# EAGLE design DRV10987 (EAGLE 9.6.2)
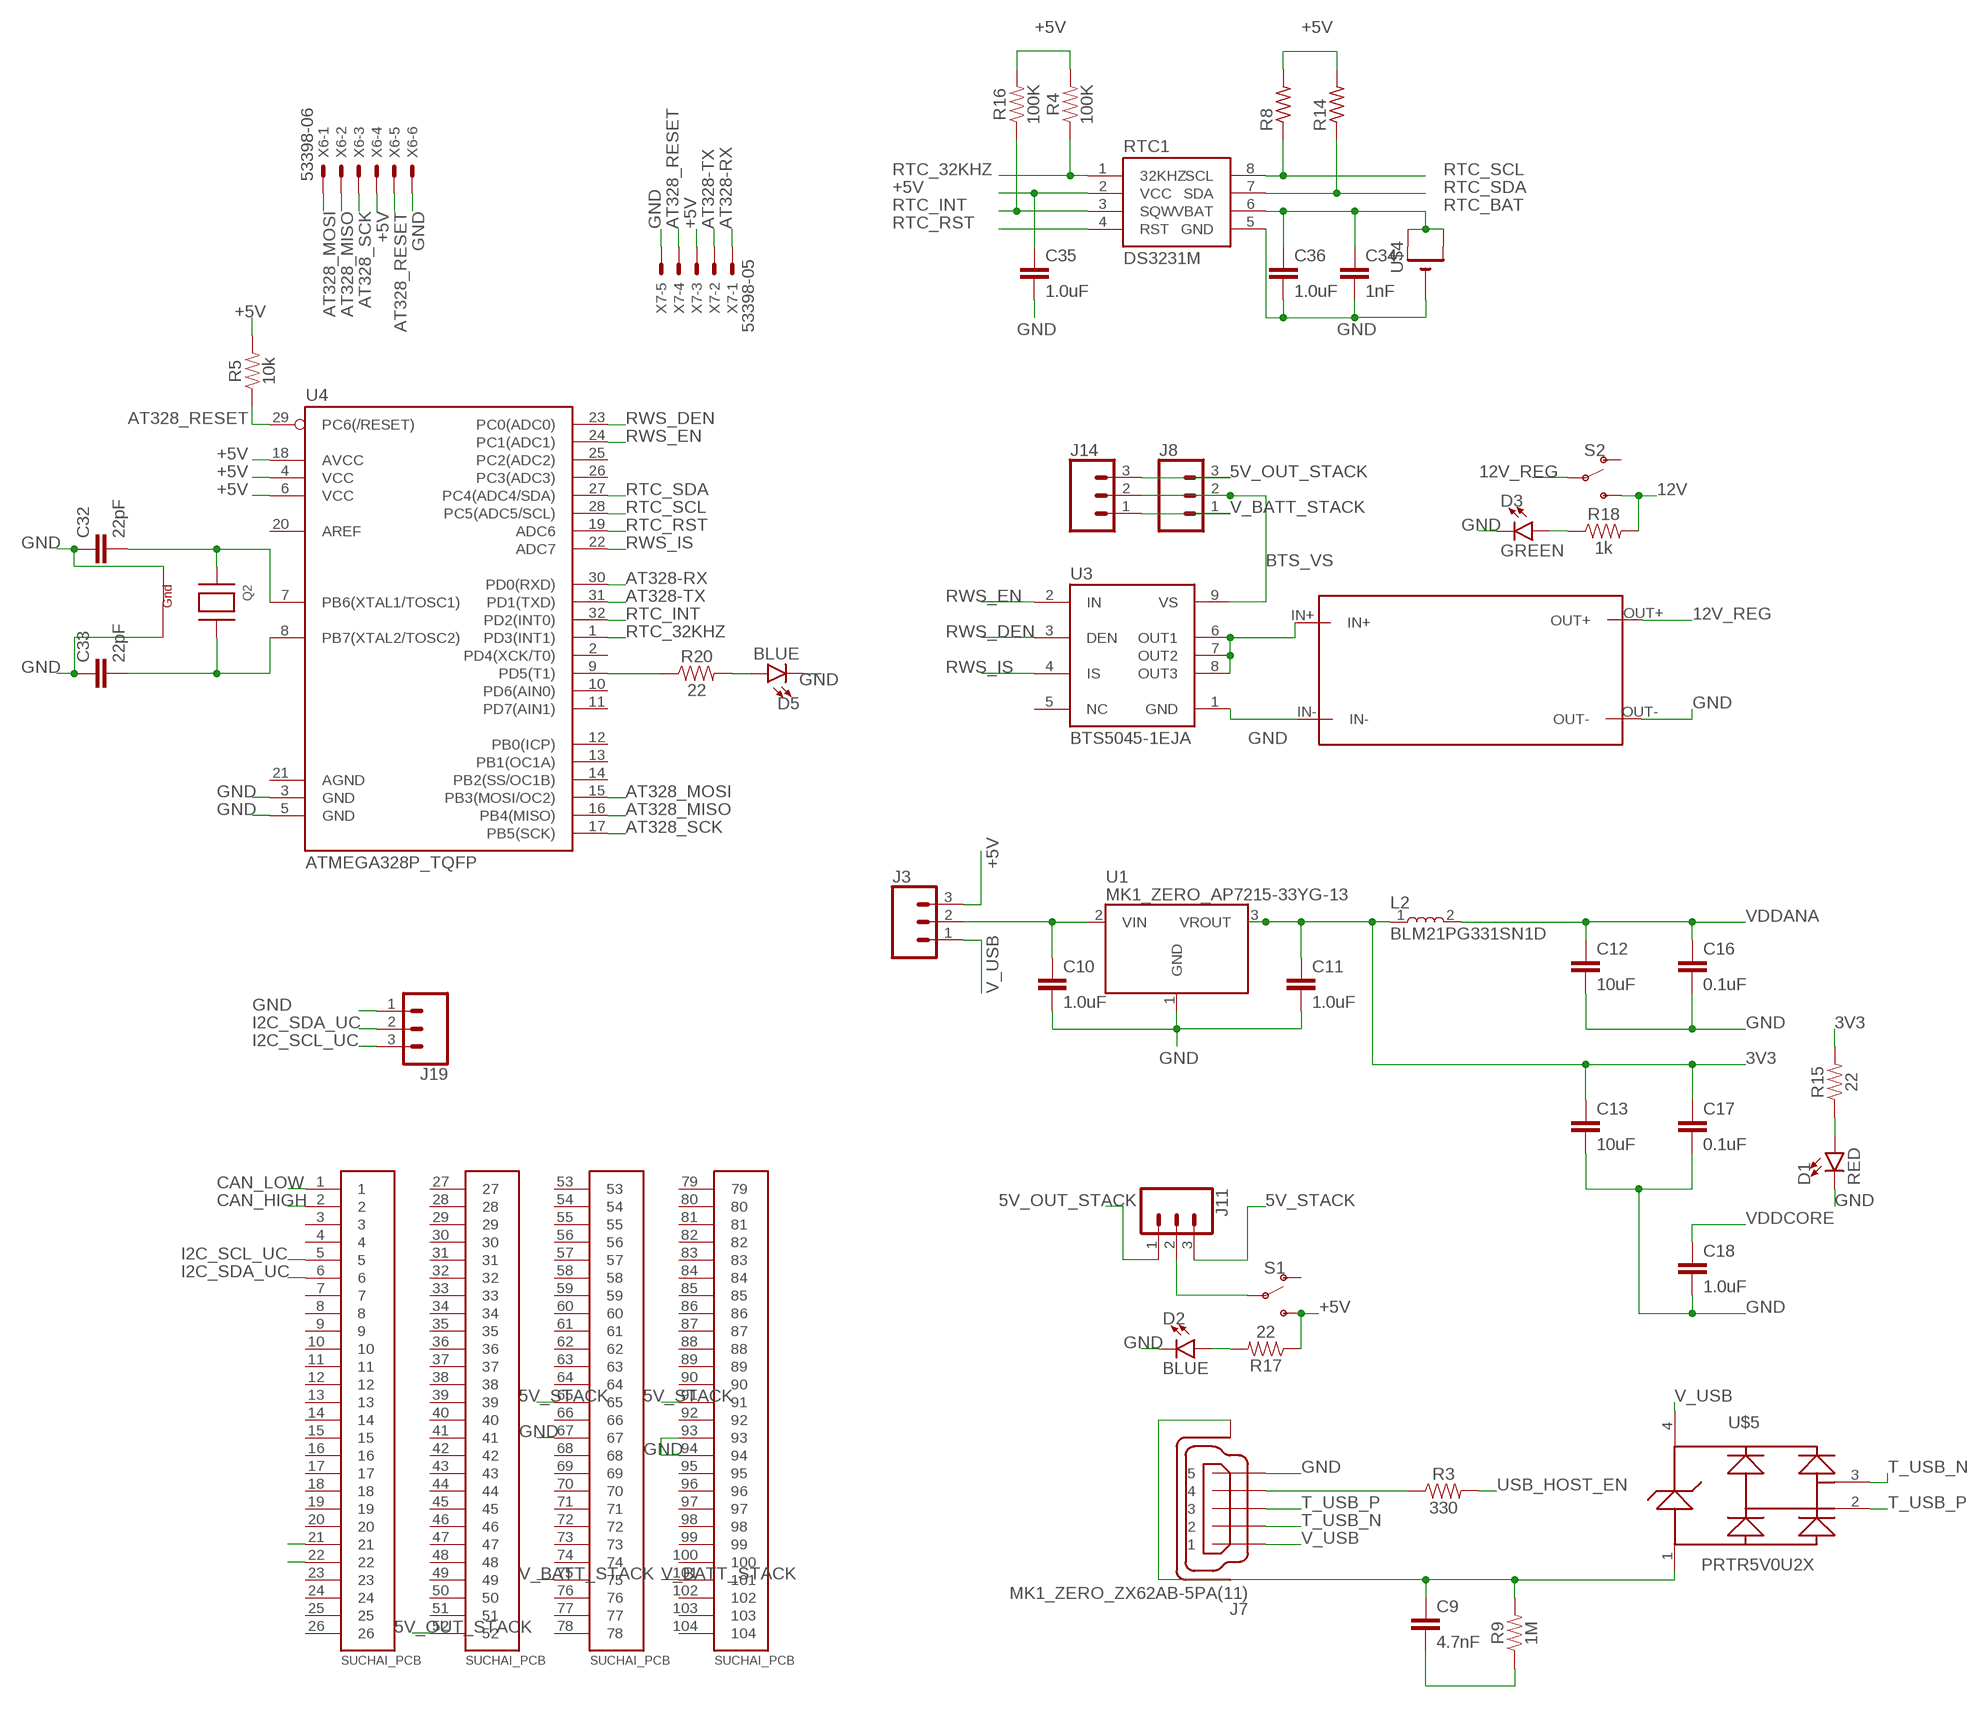
[diagram p0: schematic, sheet 1, part 1 of 2]
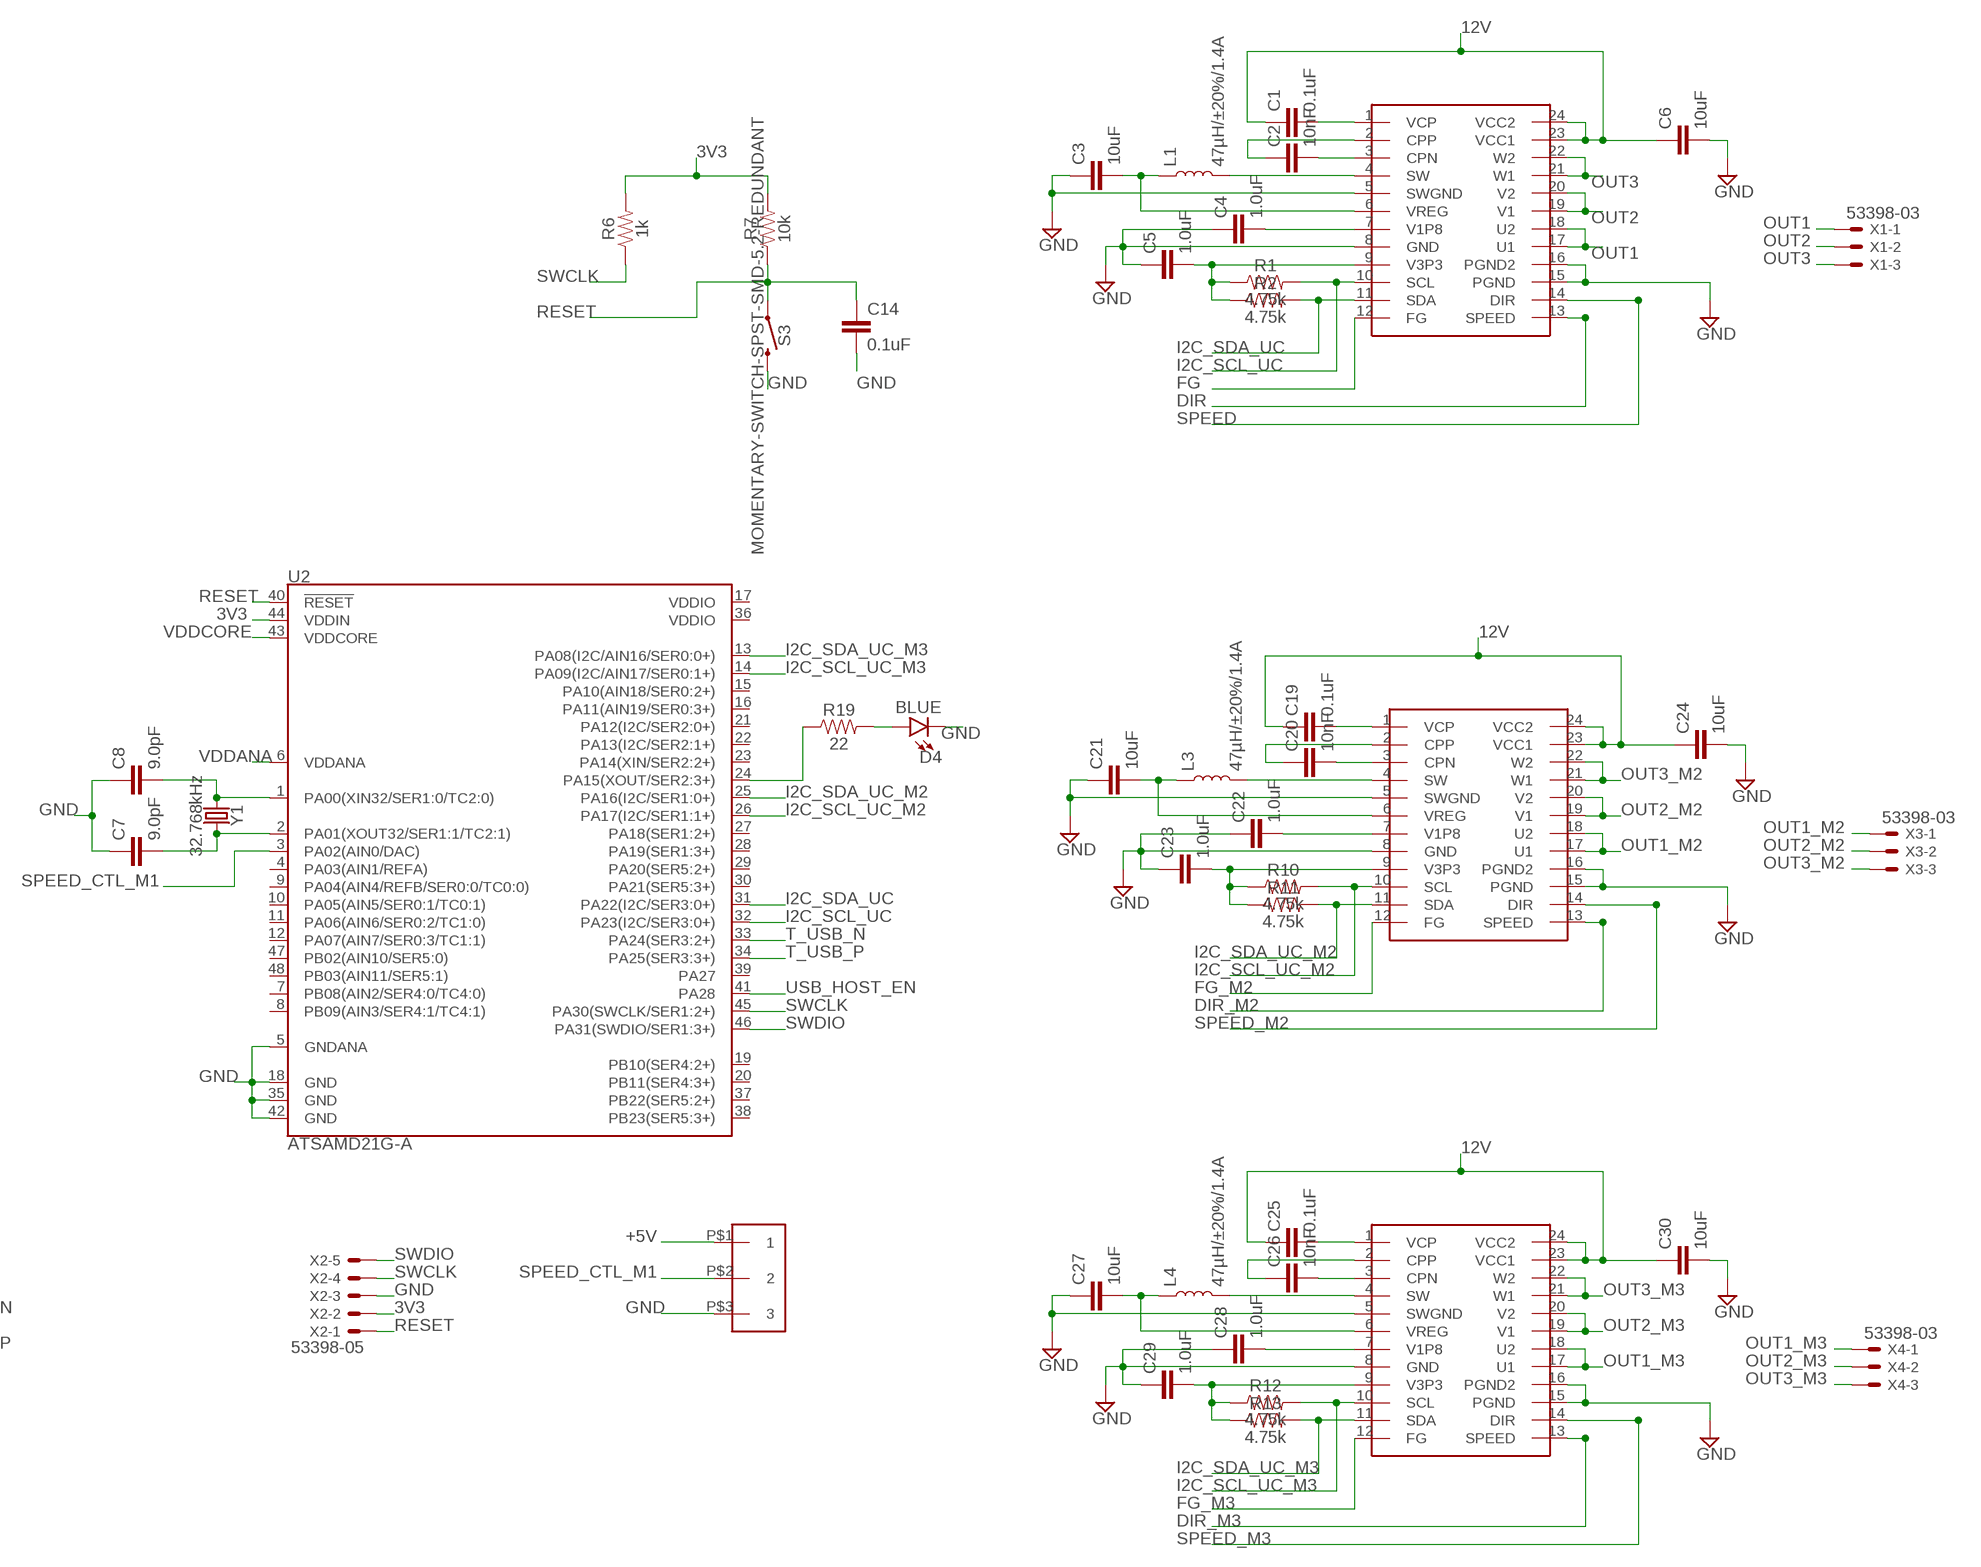
[diagram p1: schematic, sheet 1, part 2 of 2]

## Parts
C1  0.1uF  1.0UF-0805-25V-10%  [0805]
C2  10nF  1.0UF-0805-25V-10%  [0805]
C3  10uF  1.0UF-0805-25V-10%  [0805]
C4  1.0uF  1.0UF-0805-25V-10%  [0805]
C5  1.0uF  1.0UF-0805-25V-10%  [0805]
C6  10uF  1.0UF-0805-25V-10%  [0805]
C7  9.0pF  9.0PF-0603-50V-10%  [0603]
C8  9.0pF  9.0PF-0603-50V-10%  [0603]
C9  4.7nF  4.7PF-0603-50V-5%  [0603]
C10  1.0uF  1.0UF-0805-25V-(+80/-20%)  [0805]
C11  1.0uF  1.0UF-0805-25V-(+80/-20%)  [0805]
C12  10uF  10UF-0805-10V-10%  [0805]
C13  10uF  10UF-0805-10V-10%  [0805]
C14  0.1uF  1.0UF-0805-25V-(+80/-20%)  [0805]
C16  0.1uF  1.0UF-0805-25V-(+80/-20%)  [0805]
C17  0.1uF  1.0UF-0805-25V-(+80/-20%)  [0805]
C18  1.0uF  1.0UF-0805-25V-(+80/-20%)  [0805]
C19  0.1uF  1.0UF-0805-25V-10%  [0805]
C20  10nF  1.0UF-0805-25V-10%  [0805]
C21  10uF  1.0UF-0805-25V-10%  [0805]
C22  1.0uF  1.0UF-0805-25V-10%  [0805]
C23  1.0uF  1.0UF-0805-25V-10%  [0805]
C24  10uF  1.0UF-0805-25V-10%  [0805]
C25  0.1uF  1.0UF-0805-25V-10%  [0805]
C26  10nF  1.0UF-0805-25V-10%  [0805]
C27  10uF  1.0UF-0805-25V-10%  [0805]
C28  1.0uF  1.0UF-0805-25V-10%  [0805]
C29  1.0uF  1.0UF-0805-25V-10%  [0805]
C30  10uF  1.0UF-0805-25V-10%  [0805]
C32  22pF  22PF-0603-50V-5%  [0603]
C33  22pF  22PF-0603-50V-5%  [0603]
C34  1nF  1.0NF/1000PF-0603-50V-10%  [0603]
C35  1.0uF  1.0UF-0402-16V-10%  [0402]
C36  1.0uF  1.0UF-0402-16V-10%  [0402]
D1  RED  LED-RED0603  [LED-0603]
D2  BLUE  LED-BLUE0603  [LED-0603]
D3  GREEN  LED-GREEN0603  [LED-0603]
D4  BLUE  LED-BLUE0603  [LED-0603]
D5  BLUE  LED-BLUE0603  [LED-0603]
J1  SUCHAI_PCB  [SUCHAI_PCB]
J3  CONN_03LOCK_LONGPADS  [1X03_LOCK_LONGPADS]
J7  MK1_ZERO_ZX62AB-5PA(11)  [MK1_ZERO_USBMICRO-ZX62-AB-5PA]
J8  CONN_03LOCK  [1X03_LOCK]
J11  CONN_03LOCK  [1X03_LOCK]
J14  CONN_03LOCK  [1X03_LOCK]
J19  CONN_03LOCK  [1X03_LOCK]
L1  47µH/±20%/1.4A  INDUCTOR-SRN6045-33UH  [SRN6045]
L2  BLM21PG331SN1D  [INDC2012X87]
L3  47µH/±20%/1.4A  INDUCTOR-SRN6045-33UH  [SRN6045]
L4  47µH/±20%/1.4A  INDUCTOR-SRN6045-33UH  [SRN6045]
Q2  XTAL-4-3225  [NX3225]
R1  4.75k  RESISTOR0805  [0805]
R2  4.75k  RESISTOR0805  [0805]
R3  330  330OHM-0603-1/10W-1%  [0603]
R4  100K  100KOHM-0402-1/16W-1%  [0402]
R5  10k  10KOHM-0603-1/10W-1%  [0603]
R6  1k  1KOHM-0603-1/10W-1%  [0603]
R7  10k  10KOHM-0603-1/10W-1%  [0603]
R8  R-US_R0402  [R0402]
R9  1M  1MOHM-0603-1/4W-5%  [0603]
R10  4.75k  RESISTOR0805  [0805]
R11  4.75k  RESISTOR0805  [0805]
R12  4.75k  RESISTOR0805  [0805]
R13  4.75k  RESISTOR0805  [0805]
R14  R-US_R0402  [R0402]
R15  22  22OHM-0603-1/10W-1%  [0603]
R16  100K  100KOHM-0402-1/16W-1%  [0402]
R17  22  22OHM-0603-1/10W-1%  [0603]
R18  1k  1KOHM-0603-1/10W-1%  [0603]
R19  22  22OHM-0603-1/10W-1%  [0603]
R20  22  22OHM-0603-1/10W-1%  [0603]
RTC1  DS3231M  [SO08]
S1  SWITCH-SPDT-PTH-11.6X4.0MM  [SWITCH_SPDT_PTH_11.6X4.0MM]
S2  SWITCH-SPDT-PTH-11.6X4.0MM  [SWITCH_SPDT_PTH_11.6X4.0MM]
S3  MOMENTARY-SWITCH-SPST-SMD-5.2-REDUNDANT  [TACTILE_SWITCH_SMD_5.2MM]
U1  MK1_ZERO_AP7215-33YG-13  [MK1_ZERO_SOT150P400X160-3N]
U2  ATSAMD21G-A  [TQFP-48]
U3  BTS5045-1EJA  [SOIC127P600X170-9N]
U4  ATMEGA328P_TQFP  [TQFP32-08]
U$1  DRV10987  [DRV10987]
U$2  XL6009E1_MODULE  [XL6009E1_MODULE]
U$3  CONN_03_SMD_SMALL  [CONN_03_SMD_SMALL]
U$4  CR1220SMT  [CR1220-SMD]
U$5  ARDUINO_PRTR5V0U2XB  [ARDUINO_SOT143B]
U$6  DRV10987  [DRV10987]
U$7  DRV10987  [DRV10987]
X1  53398-03  [53398-03]
X2  53398-05  [53398-05]
X3  53398-03  [53398-03]
X4  53398-03  [53398-03]
X6  53398-06  [53398-06]
X7  53398-05  [53398-05]
Y1  32.768kHz  CRYSTAL-32.768KHZSMD-3.2X1.5  [CRYSTAL-SMD-3.2X1.5MM]

## Nets
3V3: C11.1 C13.1 C17.1 L2.1 R6.2 R7.2 R15.2 U1.3(VROUT) U2.44(VDDIN) X2.2
5V_OUT_STACK: J1.52 J8.3 J11.1 J14.3
5V_STACK: J1.65 J1.91 J11.3
12V: C1.1 C6.1 C19.1 C24.1 C25.1 C30.1 R18.2 S2.3(S) U$1.23(VCC1) U$1.24(VCC2) U$6.23(VCC1) U$6.24(VCC2) U$7.23(VCC1) U$7.24(VCC2)
12V_REG: S2.2(P) U$2.OUT+
+5V: C35.1 J3.3 R4.2 R5.2 R8.2 R14.2 R16.2 R17.1 RTC1.2(VCC) S1.3(S) U4.4(VCC) U4.6(VCC) U4.18(AVCC) U$3.P$1 X6.4 X7.3
AT328-RX: U4.30(PD0(RXD)) X7.1
AT328-TX: U4.31(PD1(TXD)) X7.2
AT328_MISO: U4.16(PB4(MISO)) X6.2
AT328_MOSI: U4.15(PB3(MOSI/OC2)) X6.1
AT328_RESET: R5.1 U4.29(PC6(/RESET)) X6.5 X7.4
AT328_SCK: U4.17(PB5(SCK)) X6.3
BTS_VS: J8.2 J14.2 U3.9(VS)
CAN_HIGH: J1.2
CAN_LOW: J1.1
DIR: U$1.13(SPEED)
DIR_M2: U$6.13(SPEED)
DIR_M3: U$7.13(SPEED)
FG: U$1.12(FG)
FG_M2: U$6.12(FG)
FG_M3: U$7.12(FG)
GND: C3.1 C4.1 C5.1 C6.2 C7.1 C8.1 C10.2 C11.2 C12.2 C13.2 C14.2 C16.2 C17.2 C18.2 C21.1 C22.1 C23.1 C24.2 C27.1 C28.1 C29.1 C30.2 C32.1 C33.1 C34.2 C35.2 C36.2 D1.C D2.C D3.C D4.C D5.C J1.67 J1.93 J1.94 J7.5 J19.1 Q2.2(G2) Q2.4(G1) RTC1.5(GND) S3.3 S3.4 U1.1(GND) U2.5(GNDANA) U2.18(GND) U2.35(GND) U2.42(GND) U3.1(GND) U4.3(GND) U4.5(GND) U$1.5(SWGND) U$1.8(GND) U$1.15(PGND) U$1.16(PGND2) U$2.IN- U$2.OUT- U$3.P$3 U$4.- U$6.5(SWGND) U$6.8(GND) U$6.15(PGND) U$6.16(PGND2) U$7.5(SWGND) U$7.8(GND) U$7.15(PGND) U$7.16(PGND2) X2.3 X6.6 X7.5
I2C_SCL_UC: J1.5 J19.3 R1.2 U2.32(PA23(I2C/SER3:0+)) U$1.10(SCL)
I2C_SCL_UC_M2: R10.2 U2.26(PA17(I2C/SER1:1+)) U$6.10(SCL)
I2C_SCL_UC_M3: R12.2 U2.14(PA09(I2C/AIN17/SER0:1+)) U$7.10(SCL)
I2C_SDA_UC: J1.6 J19.2 R2.2 U2.31(PA22(I2C/SER3:0+)) U$1.11(SDA)
I2C_SDA_UC_M2: R11.2 U2.25(PA16(I2C/SER1:0+)) U$6.11(SDA)
I2C_SDA_UC_M3: R13.2 U2.13(PA08(I2C/AIN16/SER0:0+)) U$7.11(SDA)
N$1: C1.2 U$1.1(VCP)
N$2: C2.1 U$1.2(CPP)
N$3: C2.2 U$1.3(CPN)
N$4: L1.2 U$1.4(SW)
N$5: J11.2 S1.2(P)
N$6: C3.2 L1.1 U$1.6(VREG)
N$7: C4.2 U$1.7(V1P8)
N$8: C7.2 U2.2(PA01(XOUT32/SER1:1/TC2:1)) Y1.P$2
N$9: C5.2 R1.1 R2.1 U$1.9(V3P3)
N$10: C8.2 U2.1(PA00(XIN32/SER1:0/TC2:0)) Y1.P$1
N$11: J7.4 R3.1
N$12: U3.6(OUT1) U3.7(OUT2) U3.8(OUT3) U$2.IN+
N$13: C32.2 Q2.1(X1) U4.7(PB6(XTAL1/TOSC1))
N$14: C33.2 Q2.3(X2) U4.8(PB7(XTAL2/TOSC2))
N$15: D1.A R15.1
N$16: J1.21
N$17: C9.1 J7.6(SH) J7.7(SH) J7.8(SH) J7.9(SH) J7.10(SH) J7.11(SH) R9.2 U$5.1
N$18: J1.22
N$19: C9.2 R9.1
N$20: C10.1 J3.2 U1.2(VIN)
N$21: D2.A R17.2
N$22: C19.2 U$6.1(VCP)
N$23: C20.1 U$6.2(CPP)
N$24: C20.2 U$6.3(CPN)
N$25: L3.2 U$6.4(SW)
N$26: C21.2 L3.1 U$6.6(VREG)
N$27: C22.2 U$6.7(V1P8)
N$28: C23.2 R10.1 R11.1 U$6.9(V3P3)
N$29: C25.2 U$7.1(VCP)
N$30: C26.1 U$7.2(CPP)
N$31: C26.2 U$7.3(CPN)
N$32: L4.2 U$7.4(SW)
N$33: C27.2 L4.1 U$7.6(VREG)
N$34: C28.2 U$7.7(V1P8)
N$35: C29.2 R12.1 R13.1 U$7.9(V3P3)
N$36: D3.A R18.1
N$37: D4.A R19.2
N$38: R19.1 U2.24(PA15(XOUT/SER2:3+))
N$39: D5.A R20.2
N$40: R20.1 U4.9(PD5(T1))
OUT1: U$1.17(U1) U$1.18(U2) X1.1
OUT1_M2: U$6.17(U1) U$6.18(U2) X3.1
OUT1_M3: U$7.17(U1) U$7.18(U2) X4.1
OUT2: U$1.19(V1) U$1.20(V2) X1.2
OUT2_M2: U$6.19(V1) U$6.20(V2) X3.2
OUT2_M3: U$7.19(V1) U$7.20(V2) X4.2
OUT3: U$1.21(W1) U$1.22(W2) X1.3
OUT3_M2: U$6.21(W1) U$6.22(W2) X3.3
OUT3_M3: U$7.21(W1) U$7.22(W2) X4.3
RESET: C14.1 R7.1 S3.1 S3.2 U2.40(!RESET!) X2.1
RTC_32KHZ: R4.1 RTC1.1(32KHZ) U4.1(PD3(INT1))
RTC_BAT: C34.1 C36.1 RTC1.6(VBAT) U$4.+$1(+) U$4.+$2(+1)
RTC_INT: R16.1 RTC1.3(SQW) U4.32(PD2(INT0))
RTC_RST: RTC1.4(RST) U4.19(ADC6)
RTC_SCL: R8.1 RTC1.8(SCL) U4.28(PC5(ADC5/SCL))
RTC_SDA: R14.1 RTC1.7(SDA) U4.27(PC4(ADC4/SDA))
RWS_DEN: U3.3(DEN) U4.23(PC0(ADC0))
RWS_EN: U3.2(IN) U4.24(PC1(ADC1))
RWS_IS: U3.4(IS) U4.22(ADC7)
SPEED: U$1.14(DIR)
SPEED_CTL_M1: U2.3(PA02(AIN0/DAC)) U$3.P$2
SPEED_M2: U$6.14(DIR)
SPEED_M3: U$7.14(DIR)
SWCLK: R6.1 U2.45(PA30(SWCLK/SER1:2+)) X2.4
SWDIO: U2.46(PA31(SWDIO/SER1:3+)) X2.5
T_USB_N: J7.2 U2.33(PA24(SER3:2+)) U$5.3
T_USB_P: J7.3 U2.34(PA25(SER3:3+)) U$5.2
USB_HOST_EN: R3.2 U2.41(PA28)
V_BATT_STACK: J1.75 J1.101 J8.1 J14.1
V_USB: J3.1 J7.1 U$5.4
VDDANA: C12.1 C16.1 L2.2 U2.6(VDDANA)
VDDCORE: C18.1 U2.43(VDDCORE)
Unconnected: J1.3 J1.4 J1.7 J1.8 J1.9 J1.10 J1.11 J1.12 J1.13 J1.14 J1.15 J1.16 J1.17 J1.18 J1.19 J1.20 J1.23 J1.24 J1.25 J1.26 J1.27 J1.28 J1.29 J1.30 J1.31 J1.32 J1.33 J1.34 J1.35 J1.36 J1.37 J1.38 J1.39 J1.40 J1.41 J1.42 J1.43 J1.44 J1.45 J1.46 J1.47 J1.48 J1.49 J1.50 J1.51 J1.53 J1.54 J1.55 J1.56 J1.57 J1.58 J1.59 J1.60 J1.61 J1.62 J1.63 J1.64 J1.66 J1.68 J1.69 J1.70 J1.71 J1.72 J1.73 J1.74 J1.76 J1.77 J1.78 J1.79 J1.80 J1.81 J1.82 J1.83 J1.84 J1.85 J1.86 J1.87 J1.88 J1.89 J1.90 J1.92 J1.95 J1.96 J1.97 J1.98 J1.99 J1.100 J1.102 J1.103 J1.104 S1.1(O) S2.1(O) U2.4(PA03(AIN1/REFA)) U2.7(PB08(AIN2/SER4:0/TC4:0)) U2.8(PB09(AIN3/SER4:1/TC4:1)) U2.9(PA04(AIN4/REFB/SER0:0/TC0:0)) U2.10(PA05(AIN5/SER0:1/TC0:1)) U2.11(PA06(AIN6/SER0:2/TC1:0)) U2.12(PA07(AIN7/SER0:3/TC1:1)) U2.15(PA10(AIN18/SER0:2+)) U2.16(PA11(AIN19/SER0:3+)) U2.17(VDDIO) U2.19(PB10(SER4:2+)) U2.20(PB11(SER4:3+)) U2.21(PA12(I2C/SER2:0+)) U2.22(PA13(I2C/SER2:1+)) U2.23(PA14(XIN/SER2:2+)) U2.27(PA18(SER1:2+)) U2.28(PA19(SER1:3+)) U2.29(PA20(SER5:2+)) U2.30(PA21(SER5:3+)) U2.36(VDDIO) U2.37(PB22(SER5:2+)) U2.38(PB23(SER5:3+)) U2.39(PA27) U2.47(PB02(AIN10/SER5:0)) U2.48(PB03(AIN11/SER5:1)) U3.5(NC) U4.2(PD4(XCK/T0)) U4.10(PD6(AIN0)) U4.11(PD7(AIN1)) U4.12(PB0(ICP)) U4.13(PB1(OC1A)) U4.14(PB2(SS/OC1B)) U4.20(AREF) U4.21(AGND) U4.25(PC2(ADC2)) U4.26(PC3(ADC3))

## Library data of the parts
C1-C3 C6 C19-C21 C24-C27 C30 = SparkFun-Capacitors:1.0UF: 1µF ceramic capacitors A capacitor is a passive two-terminal electrical component used to store electrical energy temporarily in an electric field.; PROD_ID: CAP-08064; VALUE: 1.0uF
C4 C5 C22 C23 C28 C29 = SparkFun-Capacitors:1.0UF: 1µF ceramic capacitors A capacitor is a passive two-terminal electrical component used to store electrical energy temporarily in an electric field.; PROD_ID: CAP-08064
C7 C8 = SparkFun-Capacitors:9.0PF: 9.0pF ceramic capacitors A capacitor is a passive two-terminal electrical component used to store electrical energy temporarily in an electric field.; PROD_ID: CAP-09341
C9 = SparkFun-Capacitors:4.7PF: 4.7pF ceramic capacitors A capacitor is a passive two-terminal electrical component used to store electrical energy temporarily in an electric field.; PROD_ID: CAP-07880; VALUE: 4.7pF
C10 C11 C18 = SparkFun-Capacitors:1.0UF: 1µF ceramic capacitors A capacitor is a passive two-terminal electrical component used to store electrical energy temporarily in an electric field.; PROD_ID: CAP-11625
C12 C13 = SparkFun-Capacitors:10UF: 10.0µF ceramic capacitors A capacitor is a passive two-terminal electrical component used to store electrical energy temporarily in an electric field.; PROD_ID: CAP-11330
C14 C16 C17 = SparkFun-Capacitors:1.0UF: 1µF ceramic capacitors A capacitor is a passive two-terminal electrical component used to store electrical energy temporarily in an electric field.; PROD_ID: CAP-11625; VALUE: 1.0uF
C32 C33 = SparkFun-Capacitors:22PF: 22pF ceramic capacitors A capacitor is a passive two-terminal electrical component used to store electrical energy temporarily in an electric field.; PROD_ID: CAP-07876
C34 = SparkFun-Capacitors:1.0NF/1000PF: 1nF/1,000pF ceramic capacitors A capacitor is a passive two-terminal electrical component used to store electrical energy temporarily in an electric field.; PROD_ID: CAP-07886
C35 C36 = SparkFun-Capacitors:1.0UF: 1µF ceramic capacitors A capacitor is a passive two-terminal electrical component used to store electrical energy temporarily in an electric field.; PROD_ID: CAP-12417
D1 = SparkFun-LED:LED-RED: Red SMD LED Used in manufacturing of most products at SparkFun Packages: 0603 - SMD 0603 package [Product Link] <http://docs.avagotech.com/docs/AV02-0551EN> 0603 SMART - SMD 0603 SMART package ( more efficient and expensive)[Product Link] <http://www.osram-os.com/Graphics/XPic2/00077099_0.pdf> 1206 - SMD1206 package [Product Link] <https://www.sparkfun.com/datasheets/DevTools/LilyPad/Q150OVS4.pdff> SparkFun Products: Pro Mini 328 -5V <https://www.sparkfun.com/products/821> RedBoard <https://www.sparkfun.com/products/12757> IOIO-OTG <https://www.sparkfun.com/products/13613>; PROD_ID: DIO-00819
D2 D4 D5 = SparkFun-LED:LED-BLUE: Blue SMD LED Used in manufacturing of various products at SparkFun Packages: 0603 - SMD 0603 package [Product Link] <http://www.digikey.com/product-detail/en/SMLE12BC7TT86/511-1589-2-ND/1641808> 1206 - SMD1206 package [Product Link] <http://www.digikey.com/product-detail/en/lite-on-inc/LTST-C150TBKT/160-1643-1-ND/573584> SparkFun Products: ESP8266 Thing-Dev Board <https://www.sparkfun.com/products/13711> RedBoard <https://www.sparkfun.com/products/12757>; PROD_ID: DIO-08575
D3 = SparkFun-LED:LED-GREEN: Green SMD LED Used in manufacturing of various products at SparkFun Packages: 0603 - SMD 0603 package [Product Link] <http://www.futureelectronics.com/en/technologies/semiconductors/optoelectronics/leds/Pages/9894312-LTST-C190GKT.aspx?CrossPart=HSMG-C190&IM=0> LilyPad 1206 - SMD1206 LilyPad package [Product Link] <http://www.futureelectronics.com/en/Technologies/Product.aspx?ProductID=IN150NGHARVATEKCORPORATION2049943&IM=0> 1206 - SMD1206 package [Product Link] <http://www.futureelectronics.com/en/technologies/semiconductors/optoelectronics/leds/Pages/8315665-LTST-C150KGKT.aspx?IM=0> 1206 Bottom Mount -SMD 1206 Bottom Mount [Product Link] <http://www.digikey.com/product-detail/en/lite-on-inc/LTST-C230KGKT/160-1456-1-ND/386854> SparkFun Products: Pro Mini 328 -5V <https://www.sparkfun.com/products/821> RedBoard <https://www.sparkfun.com/products/12757> MP3 Trigger <https://www.sparkfun.com/products/13720> Makey Makey <https://www.sparkfun.com/products/11076>; PROD_ID: DIO-00821
J1 = SUCHAI_PCB:SUCHAI_PCB: ASSEMBLY, SOCKET STRIP .016 X .031 TAIL.
J3 J8 J11 J14 J19 = SparkFun-Connectors:CONN_03: Multi connection point. Often used as Generic Header-pin footprint for 0.1 inch spaced/style header connections On any of the 0.1 inch spaced packages, you can populate with these: Break Away Headers - Straight <https://www.sparkfun.com/products/116> (PRT-00116) Break Away Male Headers - Right Angle <https://www.sparkfun.com/products/553> (PRT-00553) Female Headers <https://www.sparkfun.com/products/115> (PRT-00115) Break Away Headers - Machine Pin <https://www.sparkfun.com/products/117> (PRT-00117) Break Away Female Headers - Swiss Machine Pin <https://www.sparkfun.com/products/743> (PRT-00743) Stackable Header - 3 Pin (Female, 0.1") <https://www.sparkfun.com/products/13875> (PRT-13875) For SCREWTERMINALS and SPRING TERMINALS visit here: Screw Terimnals on SparkFun.com <https://www.sparkfun.com/search/results?term=Screw+Terminals> (5mm/3.5mm/2.54mm spacing) This device is also useful as a general connection point to wire up your design to another part of your project. Our various solder wires solder well into these plated through hole pads. Hook-Up Wire - Assortment (Stranded, 22 AWG) <https://www.sparkfun.com/products/11375> (PRT-11375) Hook-Up Wire - Assortment (Solid Core, 22 AWG) <https://www.sparkfun.com/products/11367> (PRT-11367) View the entire wire category on our website here <https://www.sparkfun.com/categories/141> Special notes: Molex polarized connector foot print use with SKU : PRT-08232 with associated crimp pins and housings.
J7 = MKRZero_V5.0:MK1_ZERO_ZX62AB-5PA(11)
L1 L3 L4 = SparkFun-Coils:INDUCTOR: Inductors Resist changes in electrical current. Basically a coil of wire. SparkFun Products: SparkFun Load Cell Amplifier - HX711 <https://www.sparkfun.com/products/13879> IOIO-OTG - V2.2 <https://www.sparkfun.com/products/13613>; PROD_ID: NDUC-11627; VALUE: 33µH/±20%/1.4A
L2 = Common-Parts-Library-Eagle:BLM21PG331SN1D: Ferrite Beads Multi-Layer 330Ohm 25% 100MHz 1.5A 70mOhm DCR 0805 Paper T/R; MANUFACTURER: MURATA
Q2 = adafruit:XTAL-4: Classic 4-pin 3.2 x 2.5mm crystal
R1 R2 R10-R13 = SparkFun-Resistors:RESISTOR: Generic Resistor Package
R3 = SparkFun-Resistors:330OHM: 330Ω resistor A resistor is a passive two-terminal electrical component that implements electrical resistance as a circuit element. Resistors act to reduce current flow, and, at the same time, act to lower voltage levels within circuits. - Wikipedia; PROD_ID: RES-00818
R4 R16 = SparkFun-Resistors:100KOHM: 100kΩ resistor A resistor is a passive two-terminal electrical component that implements electrical resistance as a circuit element. Resistors act to reduce current flow, and, at the same time, act to lower voltage levels within circuits. - Wikipedia; PROD_ID: RES-13495
R5 R7 = SparkFun-Resistors:10KOHM: 10kΩ resistor A resistor is a passive two-terminal electrical component that implements electrical resistance as a circuit element. Resistors act to reduce current flow, and, at the same time, act to lower voltage levels within circuits. - Wikipedia; PROD_ID: RES-00824
R6 R18 = SparkFun-Resistors:1KOHM: 1kΩ resistor A resistor is a passive two-terminal electrical component that implements electrical resistance as a circuit element. Resistors act to reduce current flow, and, at the same time, act to lower voltage levels within circuits. - Wikipedia; PROD_ID: RES-07856
R8 R14 = adafruit:R-US_: RESISTOR, American symbol
R9 = SparkFun-Resistors:1MOHM: 1MΩ resistor A resistor is a passive two-terminal electrical component that implements electrical resistance as a circuit element. Resistors act to reduce current flow, and, at the same time, act to lower voltage levels within circuits. - Wikipedia; PROD_ID: RES-07868
R15 R17 R19 R20 = SparkFun-Resistors:22OHM: 22Ω resistor A resistor is a passive two-terminal electrical component that implements electrical resistance as a circuit element. Resistors act to reduce current flow, and, at the same time, act to lower voltage levels within circuits. - Wikipedia; PROD_ID: RES-08698
RTC1 = SparkFun-Clocks:DS3231M: DS3231M Real Time Clock Accuracy +/-5ppm. Battery Backup. 2.3V to 5.5V. Datasheet <https://cdn.sparkfun.com/datasheets/Dev/Beagle/DS3231M.pdf> SparkFun Products CryptoCape <https://www.sparkfun.com/products/12773> (DEV-12773) SparkFun CryptoShield <https://www.sparkfun.com/products/13183> (DEV-13183); PROD_ID: IC-11985
S1 S2 = SparkFun-Switches:SWITCH-SPDT: Single Pole, Double Throw (SPDT) Switch Single-pole, double-throw (SPDT) switch. Variant Overview SMD-AYZ0202 Surface Mount DPDT Switch <https://www.sparkfun.com/products/597> (COM-00597) Used on e.g. LilyPad Arduino USB - ATmega32U4 Board <https://www.sparkfun.com/products/12049> PTH-11.6X4.0MM SPDT Mini Power Switch <https://www.sparkfun.com/products/102> (COM-00102) Used on e.g. SparkFun Simon Says - Through-Hole Soldering Kit <https://www.sparkfun.com/products/10547> (KIT-10547) PTH-11.6X4.0MM-KIT KIT version of SPDT Mini Power Switch - Simplifies soldering by removing tStop of switch pins - only one side can be soldered. PTH-11.6X4.0MM-LOCK LOCK version of SPDT Mini Power Switch - Offset pins hold switch in place for easier soldering. SMD-RIGHT-ANGLE Surface Mount Right Angle Switch <https://www.sparkfun.com/products/10860> (COM-10860) Used on e.g. SparkFun ESP8266 Thing <https://www.sparkfun.com/products/13231>; PROD_ID: SWCH-08261; SF_SKU: COM-00102
S3 = SparkFun-Switches:MOMENTARY-SWITCH-SPST: Momentary Switch (Pushbutton) - SPST Normally-open (NO) SPST momentary switches (buttons, pushbuttons). Variants PTH-12MM - 12mm square, through-hole Momentary Pushbutton Switch - 12mm Square <https://www.sparkfun.com/products/9190> (COM-09190) PTH-6.0MM, PTH-6.0MM-KIT - 6.0mm square, through-hole Mini Pushbutton Switch <https://www.sparkfun.com/products/97> (COM-00097) KIT package intended for soldering kit's - only one side of pads' copper is exposed. PTH-RIGHT-ANGLE-KIT - Right-angle, through-hole Right Angle Tactile Button <https://www.sparkfun.com/products/10791> - Used on SparkFun BigTime Watch Kit <https://www.sparkfun.com/products/11734> SMD-12MM - 12mm square, surface-mount Tactile Button - SMD (12mm) <https://www.sparkfun.com/products/12993> (COM-12993) Used on SparkFun PicoBoard <https://www.sparkfun.com/products/11888> SMD-4.5MM - 4.5mm Square Trackball Switch Used on SparkFun Blackberry Trackballer Breakout <https://www.sparkfun.com/products/13169> SMD-4.6MMX2.8MM - 4.60mm x 2.80mm, surface mount Used on SparkFun SAMD21 Mini Breakout <https://www.sparkfun.com/products/13664> SMD-5.2MM, SMD-5.2-REDUNDANT - 5.2mm square, surface-mount Mini Pushbutton Switch - SMD <https://www.sparkfun.com/products/8720> (COM-08720) Used on Arduino Pro Mini <https://www.sparkfun.com/products/11114> REDUNDANT package connects both switch circuits together SMD-6.0X3.5MM - 6.0 x 3.5mm, surface mount Momentary Reset Switch SMD <https://www.sparkfun.com/products/8229> (COM-08229) SMD-6.2MM-TALL - 6.2mm square, surface mount Tactile Button - SMD (6mm) <https://www.sparkfun.com/products/12992> Used on SparkFun Digital Sandbox <https://www.sparkfun.com/products/12651> SMD-RIGHT-ANGLE - Right-angle, surface mount Used on SparkFun Block for Intel® Edison - Arduino <https://www.sparkfun.com/products/13036>; PROD_ID: SWCH-08247; SF_SKU: COM-08720
U1 = MKRZero_V5.0:MK1_ZERO_AP7215-33YG-13: IC REG LDO 3.3V 0.6A SOT89-3 Datasheet <http://www.diodes.com/_files/datasheets/AP7215.pdf>; DESCR: IC REG LDO 3.3V 0.6A SOT89-3; MF: Diodes Inc; MPN: AP7215-33YG-13
U2 = SparkFun-IC-Microcontroller:ATSAMD21G: Atmel SAMD21G SMART ARM-Based Microcontroller The Atmel ® | SMART ™ SAM D21 is a series of low-power microcontrollers using the 32-bit ARM ® Cortex ® -M0+ processor, and ranging from 32- to 64-pins with up to 256KB Flash and 32KB of SRAM. The SAM D21 devices operate at a maximum frequency of 48MHz and reach 2.46 CoreMark/MHz. They are designed for simple and intuitive migration with identical peripheral modules, hex compatible code, identical linear address map and pin compatible migration paths between all devices in the product series. All devices include intelligent and flexible peripherals, Atmel Event System for inter-peripheral signaling, and support for capacitive touch button, slider and wheel user interfaces. Datasheet <https://cdn.sparkfun.com/datasheets/Dev/Arduino/Boards/Atmel-42181-SAM-D21_Datasheet.pdf> SparkFun Products SparkFun SAMD21 Mini Breakout <https://www.sparkfun.com/products/13664> (DEV-13664) SparkFun SAMD21 Dev Breakout <https://www.sparkfun.com/products/13672> (DEV-13672); PROD_ID: IC-13064
U3 = BTS5045-1EJA:BTS5045-1EJA: BTS5045-1EJA Smart High-Side Power Switch, Single Channel, 45mOhm, PROFET +12V SOIC127P600X170-9N
U4 = SparkFun-IC-Microcontroller:ATMEGA328P_TQFP: Popular 328P in QFP Storefront component: ATmega328 - TQFP <https://www.sparkfun.com/products/13448> (COM-13448) Datasheet <http://www.sparkfun.com/datasheets/Components/SMD/ATMega328.pdf> SparkFun Products SparkFun RedBoard - Programmed with Arduino <https://www.sparkfun.com/products/12757> (DEV-12757) Arduino Pro Mini 328 - 5V/16MHz <https://www.sparkfun.com/products/11113> (DEV-11113) Arduino Pro Mini 328 - 3.3V/8MHz <https://www.sparkfun.com/products/11114> (DEV-11114) SparkFun OpenLog <https://www.sparkfun.com/products/13712> (DEV-13712) SparkFun MicroView - OLED Arduino Module <https://www.sparkfun.com/products/12923> (DEV-12923) SparkFun Digital Sandbox <https://www.sparkfun.com/products/12651> (DEV-12651) SparkFun PicoBoard <https://www.sparkfun.com/products/11888> (WIG-11888) Arduino Fio <https://www.sparkfun.com/products/10116> (DEV-10116) LilyPad Arduino 328 Main Board <https://www.sparkfun.com/products/13342> (DEV-13342) SparkFun RedStick <https://www.sparkfun.com/products/13741> (DEV-13741) LilyPad MP3 <https://www.sparkfun.com/products/11013> (DEV-11013) LilyPad Arduino SimpleSnap <https://www.sparkfun.com/products/10941> (DEV-10941) SparkFun Stepoko <https://www.sparkfun.com/products/13899> (ROB-13899) SparkFun Geiger Counter <https://www.sparkfun.com/products/11345> (SEN-11345) SparkFun EL Sequencer <https://www.sparkfun.com/products/12781> (COM-12781) Arduino Pro 328 - 5V/16MHz <https://www.sparkfun.com/products/10915> (DEV-10915) CryptoCape <https://www.sparkfun.com/products/12773> (DEV-12773) SparkFun IR Thermometer Evaluation Board - MLX90614 <https://www.sparkfun.com/products/10740> (SEN-10740) SparkFun RedBot Mainboard <https://www.sparkfun.com/products/12097> (ROB-12097) Arduino Pro 328 - 3.3V/8MHz <https://www.sparkfun.com/products/10914> (DEV-10914) SparkFun Block for Intel® Edison - Arduino <https://www.sparkfun.com/products/13036> (DEV-13036) SparkFun Simon Says - Surface Mount Soldering Kit <https://www.sparkfun.com/products/10935> (KIT-10935) SparkFun 7-Segment Serial Display - Red <https://www.sparkfun.com/products/11441> (COM-11441) SparkFun 7-Segment Serial Display - White <https://www.sparkfun.com/products/11629> (COM-11629) SparkFun 7-Segment Serial Display - Yellow <https://www.sparkfun.com/products/11443> (COM-11443) SparkFun 7-Segment Serial Display - Kelly Green <https://www.sparkfun.com/products/11440> (COM-11440) SparkFun 7-Segment Serial Display - Blue <https://www.sparkfun.com/products/11442> (COM-11442) SparkFun OpenSegment Serial Display - 20mm (Blue) <https://www.sparkfun.com/products/11647> (COM-11647) SparkFun OpenSegment Serial Display - 20mm (Green) <https://www.sparkfun.com/products/11646> (COM-11646) SparkFun OpenSegment Serial Display - 20mm (White) <https://www.sparkfun.com/products/11648> (COM-11648) SparkFun OpenSegment Serial Display - 20mm (Red) <https://www.sparkfun.com/products/11644> (COM-11644) SparkFun OpenSegment Serial Display - 20mm (Yellow) <https://www.sparkfun.com/products/11645> (COM-11645) SparkFun OpenSegment Shield <https://www.sparkfun.com/products/13190> (DEV-13190); PROD_ID: IC-09069
U$1 U$6 U$7 = BLDC_DRIVER:DRV10987
U$2 = BLDC_DRIVER:XL6009E1_MODULE: High-performance step-up switching current (BOOST) module. Input Range 3V ~ 32V Output Range 5V ~ 35V Input Current 4A max Conversion efficiency ~94% Switching frequency 400KHz Working temperature -40 ° C ~ +85 ° C Dimensions 43mm * 21mm * 14mm (length * width* height)
U$3 = BLDC_DRIVER:CONN_03_SMD_SMALL
U$4 = adafruit:CR1220: CR1216/CR1220/CR1225 12mm 3V lithium coin cell Great for battery packup. Both SMT and THM holders. Note the THM package has the ground pads on both sides of the PCB so that the masks are the same - this reduces the cost
U$5 = Zero_V1.0:ARDUINO_PRTR5V0U2X
X1 X3 X4 = con-molex:53?-03: CONNECTOR wire to board 1.25 mm (.049 inch) pitch header; MF: MOLEX; OC_FARNELL: unknown; OC_NEWARK: unknown
X2 X7 = con-molex:53?-05: CONNECTOR wire to board 1.25 mm (.049 inch) pitch header; MF: MOLEX; OC_FARNELL: 1125354; OC_NEWARK: unknown
X6 = con-molex:53?-06: CONNECTOR wire to board 1.25 mm (.049 inch) pitch header; MF: MOLEX; OC_FARNELL: 1125368; OC_NEWARK: unknown
Y1 = SparkFun-Clocks:CRYSTAL-32.768KHZ: 32.768kHz Crystal Frequency: 32.768kHz Frequency Stability: ±20ppm Load Capacitance: 12.5pF (PTH-2X6 & SMD-3.2X1.5), 6pF (SMD-2X6) SparkFun Products: SparkFun BigTime Watch Kit <https://www.sparkfun.com/products/11734> SparkFun nRF52832 Breakout <https://www.sparkfun.com/products/13990> SparkFun Real Time Clock Module <https://www.sparkfun.com/products/12708>; PROD_ID: XTAL-13062

## Board
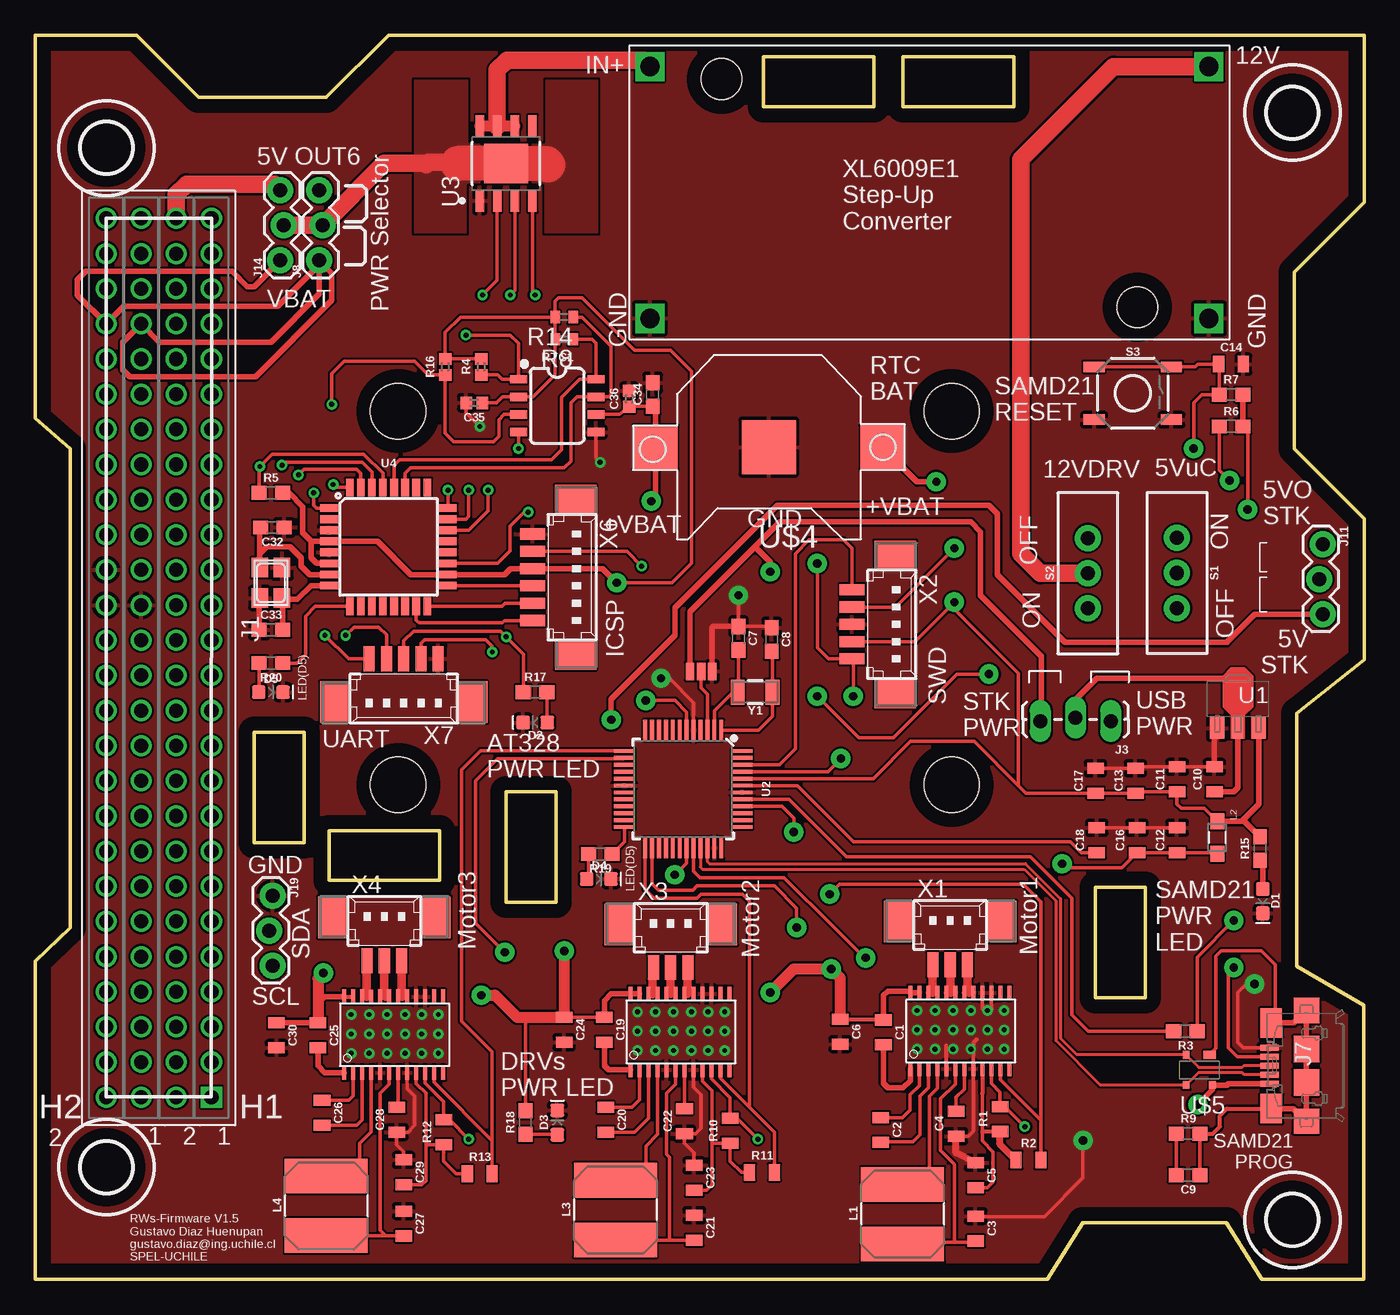
[diagram p2: board, top side]
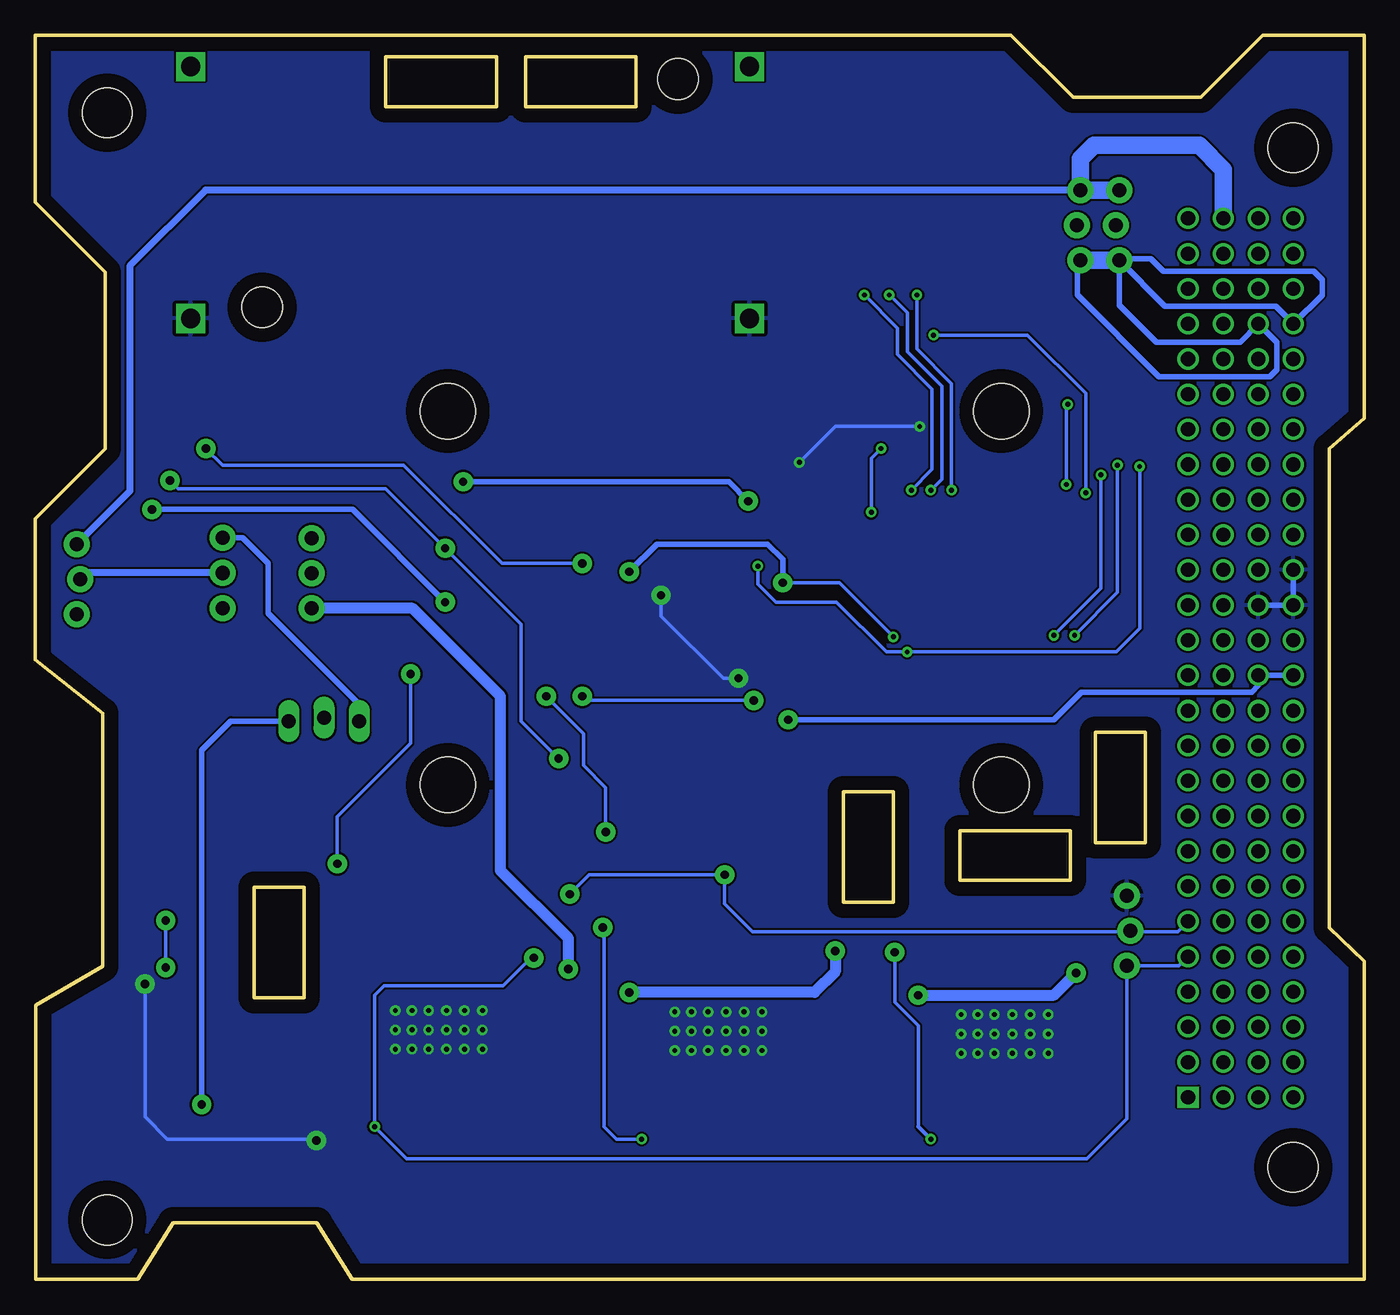
[diagram p3: board, bottom side, seen from below]

Size 96.16 x 90.01 mm. Coordinates in mm from the lower left corner, seen from the top.
Outline: 37.68,27.29 37.68,35.29 34.08,35.29 34.08,27.29 37.68,27.29
Outline: 29.28,32.49 21.28,32.49 21.28,28.89 29.28,28.89 29.28,32.49
Outline: 80.28,20.39 80.28,28.39 76.68,28.39 76.68,20.39 80.28,20.39
Outline: 70.78,88.39 62.78,88.39 62.78,84.79 70.78,84.79 70.78,88.39
Outline: 19.48,31.59 19.48,39.59 15.88,39.59 15.88,31.59 19.48,31.59
Outline: 60.68,88.39 52.68,88.39 52.68,84.79 60.68,84.79 60.68,88.39
Copper layers (1*16): Top 0.035mm / dielectric 1.5mm / Bottom 0.035mm
Design rules "default *": minimum track width 0.2mm, minimum drill 0.35mm, track to track 6mil, track to pad 6mil, pad to pad 6mil, via to via 6mil, smd to smd 6mil, copper to edge 40mil, drill to drill 6mil, minimum pad ring 10mil, minimum via ring 8mil, stop-mask expansion 4mil, vias tented up to drill 0mil, thermal gap 10mil
Holes 4 mm at 26.28,62.79 66.28,62.79 66.28,35.79 26.28,35.79
Milling: 24 lines

### Footprints (pad centres in the part's own frame; a part is rotated, then mirrored left to right if it is on the bottom)
0805 = smd 0.8 x 1.2: 1 -0.9,0; 2 0.9,0
0603 = smd 1.1 x 1: 1 -0.85,0; 2 0.85,0
0402 = smd 0.85 x 0.9: 1 -0.58,0; 2 0.58,0
LED-0603 = smd 1 x 1: A -0.877,0; C 0.877,0
SUCHAI_PCB = drill 1.016 pad 1.524 square: 1 12.72,13.16 | drill 1.016 pad 1.524: 2 12.72,15.7; 3 12.72,18.24; 4 12.72,20.78; 5 12.72,23.32; 6 12.72,25.86; 7 12.72,28.4; 8 12.72,30.94; 9 12.72,33.48; 10 12.72,36.02; 11 12.72,38.56; 12 12.72,41.1; 13 12.72,43.64; 14 12.72,46.18; 15 12.72,48.72; 16 12.72,51.26; 17 12.72,53.8; 18 12.72,56.34; 19 12.72,58.88; 20 12.72,61.42; 21 12.72,63.96; 22 12.72,66.5; 23 12.72,69.04; 24 12.72,71.58; 25 12.72,74.12; 26 12.72,76.66; 27 10.18,13.16; 28 10.18,15.7; 29 10.18,18.24; 30 10.18,20.78; 31 10.18,23.32; 32 10.18,25.86; 33 10.18,28.4; 34 10.18,30.94; 35 10.18,33.48; 36 10.18,36.02; 37 10.18,38.56; 38 10.18,41.1; 39 10.18,43.64; 40 10.18,46.18; 41 10.18,48.72; 42 10.18,51.26; 43 10.18,53.8; 44 10.18,56.34; 45 10.18,58.88; 46 10.18,61.42; 47 10.18,63.96; 48 10.18,66.5; 49 10.18,69.04; 50 10.18,71.58; 51 10.18,74.12; 52 10.18,76.66; 53 7.64,13.16; 54 7.64,15.7; 55 7.64,18.24; 56 7.64,20.78; 57 7.64,23.32; 58 7.64,25.86; 59 7.64,28.4; 60 7.64,30.94; 61 7.64,33.48; 62 7.64,36.02; 63 7.64,38.56; 64 7.64,41.1; 65 7.64,43.64; 66 7.64,46.18; 67 7.64,48.72; 68 7.64,51.26; 69 7.64,53.8; 70 7.64,56.34; 71 7.64,58.88; 72 7.64,61.42; 73 7.64,63.96; 74 7.64,66.5; 75 7.64,69.04; 76 7.64,71.58; 77 7.64,74.12; 78 7.64,76.66; 79 5.1,13.16; 80 5.1,15.7; 81 5.1,18.24; 82 5.1,20.78; 83 5.1,23.32; 84 5.1,25.86; 85 5.1,28.4; 86 5.1,30.94; 87 5.1,33.48; 88 5.1,36.02; 89 5.1,38.56; 90 5.1,41.1; 91 5.1,43.64; 92 5.1,46.18; 93 5.1,48.72; 94 5.1,51.26; 95 5.1,53.8; 96 5.1,56.34; 97 5.1,58.88; 98 5.1,61.42; 99 5.1,63.96; 100 5.1,66.5; 101 5.1,69.04; 102 5.1,71.58; 103 5.1,74.12; 104 5.1,76.66 | hole 3.6: 5.13,8.1; 90.86,4.29; 90.86,84.3; 5.13,81.76
1X03_LOCK_LONGPADS = drill 1.016 long: 1 0,0; 2 2.54,-0.254; 3 5.08,0
MK1_ZERO_USBMICRO-ZX62-AB-5PA = smd 0.4 x 1.35: 1 -1.3,3.025; 2 -0.65,3.025; 3 0,3.025; 4 0.65,3.025; 5 1.3,3.025 | smd 2.1 x 1.6: 6 3.1,2.9; 11 -3.1,2.9 | smd 1.8 x 1.9: 7 4,0.35; 10 -4,0.35 | smd 1.9 x 1.9: 8 1.2,0.35; 9 -1.2,0.35
1X03_LOCK = drill 1.016 pad 1.88: 1 0,0.127; 2 2.54,-0.127; 3 5.08,0.127
SRN6045 = smd 2.5 x 6: 1 -2.175,0; 2 2.125,0
INDC2012X87 = smd 1.15 x 1: 1 -1.175,0; 2 1.175,0
NX3225 = smd 1.4 x 1.2: 1 -1.1,-0.8; 2 1.1,-0.8; 3 1.1,0.8; 4 -1.1,0.8
R0402 = smd 0.7 x 0.9: 1 -0.65,0; 2 0.65,0
SO08 = smd 0.6 x 1.2: 1 -1.905,-2.8; 2 -0.635,-2.8; 3 0.635,-2.8; 4 1.905,-2.8; 5 1.905,2.8; 6 0.635,2.8; 7 -0.635,2.8; 8 -1.905,2.8
SWITCH_SPDT_PTH_11.6X4.0MM = drill 1.016 pad 1.88: 1 0,2.54; 2 0,0; 3 0,-2.54
TACTILE_SWITCH_SMD_5.2MM = smd 1.524 x 0.762: 1 -2.794,1.905; 2 2.794,1.905; 3 -2.794,-1.905; 4 2.794,-1.905
MK1_ZERO_SOT150P400X160-3N = smd 1.1 x 1.5: 1 -1.5,-1.8; 3 1.5,-1.8 | smd 0.8 x 1.5: 2 0,-1.8
TQFP-48 = smd 1.5 x 0.28: 1 -4.25,2.75; 2 -4.25,2.25; 3 -4.25,1.75; 4 -4.25,1.25; 5 -4.25,0.75; 6 -4.25,0.25; 7 -4.25,-0.25; 8 -4.25,-0.75; 9 -4.25,-1.25; 10 -4.25,-1.75; 11 -4.25,-2.25; 12 -4.25,-2.75; 25 4.25,-2.75; 26 4.25,-2.25; 27 4.25,-1.75; 28 4.25,-1.25; 29 4.25,-0.75; 30 4.25,-0.25; 31 4.25,0.25; 32 4.25,0.75; 33 4.25,1.25; 34 4.25,1.75; 35 4.25,2.25; 36 4.25,2.75 | smd 0.28 x 1.5: 13 -2.75,-4.25; 14 -2.25,-4.25; 15 -1.75,-4.25; 16 -1.25,-4.25; 17 -0.75,-4.25; 18 -0.25,-4.25; 19 0.25,-4.25; 20 0.75,-4.25; 21 1.25,-4.25; 22 1.75,-4.25; 23 2.25,-4.25; 24 2.75,-4.25; 37 2.75,4.25; 38 2.25,4.25; 39 1.75,4.25; 40 1.25,4.25; 41 0.75,4.25; 42 0.25,4.25; 43 -0.25,4.25; 44 -0.75,4.25; 45 -1.25,4.25; 46 -1.75,4.25; 47 -2.25,4.25; 48 -2.75,4.25
SOIC127P600X170-9N = smd 1.6 x 0.6: 1 -2.7,1.905; 2 -2.7,0.635; 3 -2.7,-0.635; 4 -2.7,-1.905; 5 2.7,-1.905; 6 2.7,-0.635; 7 2.7,0.635; 8 2.7,1.905 | smd 2.85 x 3.2: 9 0,0
TQFP32-08 = smd 1.27 x 0.559: 1 -4.293,2.8; 2 -4.293,2; 3 -4.293,1.2; 4 -4.293,0.4; 5 -4.293,-0.4; 6 -4.293,-1.2; 7 -4.293,-2; 8 -4.293,-2.8; 17 4.293,-2.8; 18 4.293,-2; 19 4.293,-1.2; 20 4.293,-0.4; 21 4.293,0.4; 22 4.293,1.2; 23 4.293,2; 24 4.293,2.8 | smd 0.559 x 1.27: 9 -2.8,-4.293; 10 -2,-4.293; 11 -1.2,-4.293; 12 -0.4,-4.293; 13 0.4,-4.293; 14 1.2,-4.293; 15 2,-4.293; 16 2.8,-4.293; 25 2.8,4.293; 26 2,4.293; 27 1.2,4.293; 28 0.4,4.293; 29 -0.4,4.293; 30 -1.2,4.293; 31 -2,4.293; 32 -2.8,4.293
DRV10987 = smd 0.3 x 1.05: 1 0.3,-0.5; 2 0.95,-0.5; 3 1.6,-0.5; 4 2.25,-0.5; 5 2.9,-0.5; 6 3.55,-0.5; 7 4.2,-0.5; 8 4.85,-0.5; 9 5.5,-0.5; 10 6.15,-0.5; 11 6.8,-0.5; 12 7.45,-0.5; 13 7.45,5; 14 6.8,5; 15 6.15,5; 16 5.5,5; 17 4.85,5; 18 4.2,5; 19 3.55,5; 20 2.9,5; 21 2.25,4.98; 22 1.6,5; 23 0.95,5; 24 0.3,5
XL6009E1_MODULE = drill 1.4 square: IN+ 1.5,19.7; IN- 1.5,1.5; OUT+ 41.9,19.7; OUT- 41.9,1.5 | hole 2.95: 6.66,18.8; 36.74,2.32
CONN_03_SMD_SMALL = smd 0.6 x 1.27: P$1 -0.8,0; P$2 0,0; P$3 0.8,0
CR1220-SMD = smd 3.2 x 3.2: +$1 -8.2,0; +$2 8.2,0 | smd 3.9 x 3.9: - 0,0
ARDUINO_SOT143B = smd 0.88 x 0.55: 1 -0.75,-1.1 | smd 0.48 x 0.55: 2 0.95,-1.1; 3 0.95,1.1; 4 -0.95,1.1
53398-03 = smd 0.8 x 1.8: 1 1.25,-2.5; 2 0,-2.5; 3 -1.25,-2.5 | smd 2.1 x 3: S1 3.75,0.625; S2 -3.75,0.625
53398-05 = smd 0.8 x 1.8: 1 2.5,-2.5; 2 1.25,-2.5; 3 0,-2.5; 4 -1.25,-2.5; 5 -2.5,-2.5 | smd 2.1 x 3: S1 5,0.625; S2 -5,0.625
53398-06 = smd 0.8 x 1.8: 1 3.125,-2.5; 2 1.875,-2.5; 3 0.625,-2.5; 4 -0.625,-2.5; 5 -1.875,-2.5; 6 -3.125,-2.5 | smd 2.1 x 3: S1 5.625,0.625; S2 -5.625,0.625
CRYSTAL-SMD-3.2X1.5MM = smd 1 x 1.8: P$1 -1.25,0; P$2 1.25,0

### Placement (x,y rotation side)
C1  61.36,17.9 270 top
C2  61.17,10.85 270 top
C3  68.02,3.73 270 top
C4  66.61,11.3 90 top
C5  68.01,7.58 270 top
C6  58.23,17.95 270 top
C7  50.88,46.39 270 top
C8  53.28,46.29 270 top
C9  83.38,7.59 180 top
C10  85.28,36.19 90 top
C11  82.58,36.19 90 top
C12  82.58,31.79 90 top
C13  79.58,36.09 90 top
C14  86.48,66.19 0 top
C16  79.68,31.79 90 top
C17  76.68,36.09 90 top
C18  76.78,31.79 90 top
C19  41.18,18.09 270 top
C20  41.28,11.59 270 top
C21  47.68,3.79 270 top
C22  46.98,11.49 90 top
C23  47.68,7.39 270 top
C24  38.28,18.09 270 top
C25  20.48,17.69 270 top
C26  20.78,12.09 270 top
C27  26.68,4.09 270 top
C28  26.18,11.59 90 top
C29  26.68,7.79 270 top
C30  17.48,17.69 270 top
C32  17.18,54.39 180 top
C33  17.08,46.99 0 top
C34  44.68,63.99 90 top
C35  31.78,63.39 180 top
C36  42.98,63.69 90 top
D1  88.78,27.39 270 top
D2  36.18,40.29 180 top
D3  37.78,11.39 90 top
D4  40.78,28.99 0 top
D5  17.08,42.49 0 top
J1  0.06,0.06 0 top
J3  77.78,40.39 180 top
J7  92.28,15.49 90 top
J8  20.68,73.69 90 top
J11  92.98,53.19 270 top
J14  17.88,73.69 90 top
J19  17.08,27.79 270 top
L1  62.74,4.8 90 top
L2  85.48,31.99 270 top
L3  41.98,5.09 90 top
L4  21.08,5.39 90 top
Q2  17.08,50.39 270 top
R1  69.79,11.64 90 top
R2  71.83,8.68 0 top
R3  83.18,17.99 180 top
R4  32.28,65.99 90 top
R5  17.08,56.89 0 top
R6  86.48,61.69 0 top
R7  86.48,63.99 0 top
R8  38.28,67.99 180 top
R9  83.38,10.59 0 top
R10  50.28,10.79 90 top
R11  52.58,7.79 0 top
R12  29.58,10.69 90 top
R13  32.18,7.69 0 top
R14  38.28,69.59 180 top
R15  88.58,31.19 90 top
R16  29.68,65.99 90 top
R17  36.18,42.49 0 top
R18  35.48,11.39 90 top
R19  40.88,30.79 180 top
R20  17.08,44.59 180 top
RTC1  37.78,63.19 270 top
S1  82.58,51.1 180 top
S2  76.13,51.08 0 top
S3  79.38,64.09 0 top
U1  86.98,41.69 0 top
U2  46.88,35.49 270 top
U3  34.08,80.69 90 top
U4  25.58,52.99 0 top
U$1  63,15.76 0 top
U$2  42.98,67.99 0 top
U$3  48.18,43.99 0 top
U$4  53.08,60.19 180 top
U$5  84.18,15.19 180 top
U$6  42.78,15.69 0 top
U$7  22.08,15.49 0 top
X1  66.18,25.29 0 top
X2  61.58,47.39 270 top
X3  45.98,25.09 0 top
X4  25.28,25.59 0 top
X6  38.48,50.79 270 top
X7  26.68,42.39 180 top
Y1  52.08,42.49 180 top

### Tracks (layer width: path | path; a pad name or v marks a point on that pad's centre or on a via)
3V3  (via drill 0.6 pad 1.4)
  Top 0.254: U2.44 60.63,36.24 63.33,38.94 67.93,38.94 71.13,35.74 | v87.68,55.69 87.68,61.34 R6.2 | L2.1 84.56,34.09 82.88,34.09 82.58,34.39 C11.1 79.68,35.29 C13.1 C17.1 71.67,35.19 71.13,35.74 | 71.13,35.74 71.13,43.85 66.48,48.49 v66.48,48.99 63.63,46.14 X2.2
  Top 0.406: R6.2 R7.2 | L2.1 87.08,33.17 87.26,33.17 | 87.26,33.17 88.48,34.39 U1.3 | R15.2 87.46,33.17 87.26,33.17
  Bottom 0.406: v66.48,48.99 73.18,55.69 v87.68,55.69
5V_OUT_STACK
  Top 1.27: J1.52 10.24,78.45 10.98,79.19 17.34,79.19 J14.3
  Bottom 0.508: J8.3 83.8,78.77 89.28,73.29 89.28,57.02 J11.1
  Bottom 1.27: J14.3 J8.3 20.56,81.02 19.58,81.99 11.98,81.99 10.24,80.25 J1.52
5V_STACK  (via drill 0.6 pad 1.4)
  Top 0.406: J11.3 88.2,48.11 86.18,46.09 74.48,46.09 69.58,50.99 69.58,55.39 68.98,55.99 53.68,55.99 46.28,48.59 46.28,46.59 41.68,41.99 v41.68,40.49
  Bottom 0.406: v41.68,40.49 22.48,40.49 20.48,42.49 8.18,42.49 7.7,42.97 J1.65 J1.91
12V  (via drill 0.6 pad 1.4)
  Top 0.254: C19.1 C24.1 | R18.2 35.48,18.99
  Top 0.305: U$1.24 63.17,20.89 | C1.1 58.28,18.8 C6.1 | U$7.24 U$7.23
  Top 0.406: U$1.23 U$1.24 | 63.17,20.89 61.68,20.89 61.36,20.57 C1.1 | U$6.23 U$6.24 41.68,20.69 41.18,20.19 C19.1 | U$7.24 20.98,20.49 20.48,19.99 20.48,18.79 C25.1 C30.1
  Top 0.813: v20.88,22.19 20.48,21.79 20.48,18.79 | v38.28,23.79 C24.1 35.48,18.99 34.88,18.99 33.28,20.59 v32.28,20.59 | C6.1 58.23,21.84 v57.58,22.49 54.88,22.49 v53.18,20.79
  Bottom 0.813: v38.28,23.79 38.28,22.29 39.78,20.79 v53.18,20.79 | v20.88,22.19 22.48,20.59 v32.28,20.59 | v57.58,22.49 57.58,24.69 62.48,29.59 62.48,42.19 68.83,48.54 S2.3
12V_REG
  Top 1.27: S2.2 72.69,51.08 71.28,52.49 71.28,80.99 77.98,87.69 U$2.OUT+
+5V  (via drill 0.35, 0.6 pad 1.4)
  Top 0.254: X7.3 26.68,46.19 27.38,46.89 33.68,46.89 v34.08,46.49 35.33,45.24 R17.1 | C35.1 33.38,63.39 33.82,63.83 RTC1.2 36.02,63.83 37.63,65.44 R8.2 R14.2 | R4.2 R16.2 29.68,68.49 30.78,69.59 R14.2 | R14.2 37.63,70.74 37.88,70.99 39.58,70.99 43.38,67.19 45.98,67.19 47.48,65.69 47.48,51.79 46.08,50.39 v42.08,50.39
  Top 0.406: J3.3 72.78,40.47 72.78,45.09 68.38,49.49 68.38,54.09 67.68,54.79 53.88,54.79 52.08,52.99 | U$3.P$1 47.38,48.29 52.08,52.99 | 19.98,53.39 U4.4 24.78,53.39 27.18,50.99 U4.18 33.98,50.99 34.41,51.42 X6.4 41.06,51.42 v42.08,50.39 | R5.2 18.38,56.89 19.38,55.89 19.38,53.99 19.98,53.39 | 52.08,52.99 53.18,51.89 v53.18,51.19 | U4.6 20.38,51.79 19.98,52.19 19.98,53.39
  Bottom 0.254: v34.08,46.49 37.98,50.39 v42.08,50.39
  Bottom 0.406: S1.3 81.13,53.64 79.28,51.79 79.28,48.19 72.7,41.61 J3.3 | v53.18,51.19 51.18,53.19 43.18,53.19 42.08,52.09 v42.08,50.39
AT328-RX  (via drill 0.35)
  Top 0.254: v20.98,46.59 22.68,44.89 X7.1 | U4.30 24.38,58.39 23.68,59.09 18.08,59.09 v17.88,58.89
  Bottom 0.254: v17.88,58.89 17.88,49.69 v20.98,46.59
AT328-TX  (via drill 0.35)
  Top 0.254: X7.2 25.43,46.64 24.88,47.19 23.08,47.19 v22.48,46.59 | U4.31 23.58,58.29 23.28,58.59 19.48,58.59 v19.08,58.19
  Bottom 0.254: v19.08,58.19 19.08,49.99 v22.48,46.59
AT328_MISO
  Top 0.254: U4.16 33.79,48.7 34.01,48.92 X6.2
AT328_MOSI
  Top 0.254: U4.15 27.58,47.69 27.78,47.49 33.78,47.49 33.96,47.67 X6.1
AT328_RESET  (via drill 0.35)
  Top 0.254: X7.4 27.93,46.04 28.18,46.29 32.58,46.29 33.08,45.79 v33.08,45.39 | U4.29 25.18,58.29 23.78,59.69 17.18,59.69 v16.28,58.79 16.23,58.74 R5.1 | v43.88,51.59 42.81,52.67 X6.5
  Bottom 0.254: v16.28,58.79 16.28,49.69 16.28,49.39 16.28,47.09 17.98,45.39 20.28,45.39 20.38,45.39 v33.08,45.39 34.58,45.39 38.18,48.99 42.58,48.99 43.88,50.29 v43.88,51.59
AT328_SCK
  Top 0.254: U4.17 35.96,50.19
  Top 0.406: 35.96,50.19 X6.3
BTS_VS
  Top 1.27: U3.9 33.98,80.79 28.48,80.79 28.28,80.59 28.18,80.69 25.27,80.69 J8.2 J14.2
  Top 2.54: 30.58,80.69 U3.9 36.98,80.69 37.08,80.59
  pour Top: 36.08,79.29 36.08,81.99 36.18,82.09 36.88,82.09 36.98,82.19 36.98,82.59 37.08,82.69 40.48,82.69 40.68,82.49 40.68,78.79 40.58,78.69 36.98,78.69 36.88,78.79 36.88,79.19 36.78,79.29
  pour Top: 32.08,82.09 32.08,79.39 31.98,79.29 31.28,79.29 31.18,79.19 31.18,78.79 31.08,78.69 27.68,78.69 27.48,78.89 27.48,82.59 27.58,82.69 31.18,82.69 31.28,82.59 31.28,82.19 31.38,82.09
  pour Top: 27.48,86.69 27.48,75.69 31.18,75.69 31.18,79.19 31.28,79.29 36.78,79.29 36.88,79.19 36.88,75.69 40.68,75.69 40.68,86.69 36.98,86.69 36.98,82.19 36.88,82.09 31.38,82.09 31.28,82.19 31.28,86.69
GND  (via drill 0.35, 0.6 pad 1.4)
  Top 0.254: 67.88,17.18 67.88,16.89 67.88,16.29 67.85,16.26 U$1.8 67.85,10.76 67.49,10.4 C4.1 | U$1.15 69.15,19.62 | 69.15,19.62 69.18,19.59 | 69.15,19.62 69.08,19.69 | 68.5,19.56 U$1.16 | C23.1 47.68,9.19 46.98,9.89 C22.1 47.78,10.59 48.18,10.99 48.18,13.39 47.63,13.94 U$6.8 | C29.1 26.68,9.29 26.18,9.79 C28.1 26.98,10.69 27.48,11.19 27.48,13.29 26.93,13.84 U$7.8 | C18.2 C16.2 C12.2 | C10.2 C11.2 79.68,37.09 C13.2 C17.2 | C8.1 53.18,47.24 C7.1 v50.88,49.49 | v75.78,10.09 75.78,7.39 72.98,4.59 68.06,4.59 C3.1 | J7.5 87.38,16.79 86.98,17.19 86.98,20.79 87.58,21.39 v88.18,21.39 | U2.5 47.63,41.74 45.88,43.49 v45.28,43.49 | C35.2 31.2,62.67 v32.18,61.69 | v40.88,59.09 40.58,59.39 RTC1.5
  Top 0.305: 68.09,17.39 67.88,17.18 | 67.78,16.79 67.88,16.89 | U$1.5 65.9,16.96
  Top 0.406: C7.1 49.08,47.24 48.98,47.14 U$3.P$3 | C10.2 85.28,39.69 U1.1 | C33.1 16.23,49.24 Q2.2
  Top 0.508: C5.1 66.61,9.2 C4.1
  Bottom 0.254: v75.78,10.09 75.88,10.19 86.58,10.19 88.18,11.79 v88.18,21.39 | v45.28,43.49 46.38,43.49 50.88,47.99 v50.88,49.49 | v32.18,61.69 38.28,61.69 v40.88,59.09
  Bottom 0.406: J1.67 J1.93 J1.94
  other vias: 63.78,16.69 63.78,18.09 63.78,19.49 65.08,16.69 65.08,18.09 65.08,19.49 66.38,16.69 66.38,18.09 66.38,19.49 67.68,16.69 67.68,18.09 67.68,19.49 68.88,16.69 68.88,18.09 68.88,19.49 70.08,16.69 70.08,18.09 70.08,19.49 43.58,16.59 43.58,17.99 43.58,19.39 44.88,16.59 44.88,17.99 44.88,19.39 46.18,16.59 46.18,17.99 46.18,19.39 47.48,16.59 47.48,17.99 47.48,19.39 48.68,16.59 48.68,17.99 48.68,19.39 49.88,16.59 49.88,17.99 49.88,19.39 22.88,16.39 22.88,17.79 22.88,19.19 24.18,16.39 24.18,17.79 24.18,19.19 25.48,16.39 25.48,17.79 25.48,19.19 26.78,16.39 26.78,17.79 26.78,19.19 27.98,16.39 27.98,17.79 27.98,19.19 29.18,16.39 29.18,17.79 29.18,19.19
  pour Bottom (rank 5): 0.08,0.09 73.28,-0.01 75.88,4.19 86.18,4.19 88.78,0.09 95.98,0.09 95.98,19.79 91.08,22.49 90.88,41.49 95.58,44.99 95.48,54.89 90.48,59.79 90.58,73.19 95.88,78.39 95.78,89.69 26.48,89.99 21.58,85.09 11.28,85.19 7.38,89.09 0.28,89.09 0.18,62.59 2.58,60.29 2.78,24.69 0.08,21.89
  pour Top (rank 5): 0.18,0.09 73.38,-0.01 75.98,4.09 87.08,3.99 89.28,-0.01 96.48,0.09 96.48,19.79 90.88,23.19 90.98,41.39 95.98,44.99 96.08,55.09 91.08,59.89 91.18,73.29 95.78,77.99 95.88,89.99 25.88,89.99 21.28,85.29 11.88,85.19 7.68,89.69 0.08,89.79 0.28,62.89 2.58,60.79 2.58,24.59 0.28,22.29 0.08,22.09 0.08,0.09
I2C_SCL_UC  (via drill 0.35, 0.6 pad 1.4)
  Top 0.254: U$1.10 69.15,14.22 69.79,13.58 R1.2 70.13,12.54 v71.58,11.09 | U2.32 47.63,29.54 48.08,29.09 54.18,29.09 55.88,27.39 56.03,27.24 59.98,23.29 v60.08,23.29
  Bottom 0.254: v60.08,23.29 60.28,23.29 62.28,21.29 70.88,21.29 71.58,20.59 v71.58,11.09 69.28,8.79 20.08,8.79 17.21,11.67 J19.3 13.45,22.71 J1.5
I2C_SCL_UC_M2  (via drill 0.35, 0.6 pad 1.4)
  Top 0.254: U$6.10 48.93,14.54 50.28,13.19 R10.2 50.78,11.69 v52.28,10.19 | U2.26 44.63,28.64 45.08,28.19 47.58,28.19 47.88,28.49 53.48,28.49 55.08,26.89 v55.08,25.49
  Bottom 0.254: v52.28,10.19 54.08,10.19 54.98,11.09 54.98,25.39 v55.08,25.49
I2C_SCL_UC_M3  (via drill 0.35, 0.6 pad 1.4)
  Top 0.254: U$7.10 28.23,14.24 29.58,12.89 R12.2 29.98,11.59 v31.38,10.19 | U2.14 42.58,37.69 33.48,37.69 31.88,36.09 31.88,33.89 31.88,33.79 31.88,25.79 v33.98,23.69
  Bottom 0.254: 32.28,11.09 32.28,18.39 33.98,20.09 v33.98,23.69
  Bottom 0.305: v31.38,10.19 32.28,11.09
I2C_SDA_UC  (via drill 0.6 pad 1.4)
  Top 0.254: U$1.11 69.8,14.47 72.73,11.54 | 72.73,11.54 R2.2 | 72.73,11.54 72.73,27.34 71.48,28.59 58.18,28.59 v57.48,27.89 | v46.28,29.29 47.13,30.14 U2.31
  Bottom 0.254: v57.48,27.89 56.08,29.29 v46.28,29.29 46.28,27.19 44.28,25.19 17.02,25.19 | 17.02,25.19 J19.2 | J1.6 13.51,25.19 17.02,25.19
I2C_SDA_UC_M2
  Top 0.254: U$6.11 49.58,14.59 51.68,12.49 | 51.68,12.49 53.48,10.69 R11.2 | U2.25 44.13,28.24 44.78,27.59 47.88,27.59 48.18,27.89 51.18,27.89 51.68,27.39 51.68,12.49
I2C_SDA_UC_M3
  Top 0.254: U$7.11 28.88,14.29 33.08,10.09 | 33.08,10.09 R13.2 | 33.08,10.09 33.08,16.49 30.88,18.69 30.88,36.89 32.23,38.24 U2.13
N$1
  Top 0.406: U$1.1 63.3,14.41 62.78,13.89 61.68,13.89 61.36,14.21 C1.2
N$2
  Top 0.254: U$1.2 63.95,14.06 63.28,13.39 63.28,12.29 62.74,11.75 C2.1
N$3
  Top 0.254: U$1.3 64.6,13.91 63.98,13.29 63.98,10.49 63.48,9.99 61.21,9.99 C2.2
N$4
  Top 0.254: U$1.4 65.25,13.86 64.68,13.29 64.68,7.59 64.28,7.19
  Top 0.305: L1.2 64.02,6.93 64.28,7.19
N$5
  Bottom 0.508: S1.2 92.41,51.1 J11.2
N$6
  Top 0.254: U$1.6 66.55,14.16 65.48,13.09 65.48,9.39 66.48,8.39 66.48,2.76 | 66.48,2.76 64.49,2.76 | 66.48,2.76 67.95,2.76 C3.2
  Top 0.305: 64.49,2.76 63.19,2.66 L1.1
N$7
  Top 0.254: U$1.7 67.2,13.81 66.61,13.22 C4.2
N$8
  Top 0.254: U2.2 49.13,41.14 50.88,42.89 | C7.2 50.88,42.89 | Y1.P$2 50.88,42.54 50.88,42.89
N$9
  Top 0.254: 68.5,13.47 68.5,10.69 68.5,10.07 69.28,9.29 69.28,7.09 68.87,6.68 C5.2
  Top 0.305: U$1.9 68.5,13.47 | R1.1 68.55,10.74 68.5,10.69
  Top 0.508: R2.1 69.79,9.82 R1.1
N$10
  Top 0.254: C8.2 53.33,45.39 Y1.P$1 53.33,40.74 52.33,39.74 U2.1
N$11  (via drill 0.6 pad 1.4)
  Top 0.254: J7.4 86.93,16.14 86.28,16.79 86.28,22.09 86.68,22.49 v86.68,22.59 | v86.68,25.99 84.03,23.34 R3.1
  Bottom 0.254: v86.68,22.59 v86.68,25.99
N$12
  Top 0.813: U3.6 U3.7 U3.8
  Top 1.27: U$2.IN+ 44.01,88.17 34.16,88.17 33.45,87.46 U3.7
N$13
  Top 0.406: U4.7 19.88,50.99 19.28,51.59 19.28,52.19 18.48,52.99 16.78,52.99 16.28,52.49 Q2.1 16.28,54.34 C32.2
N$14
  Top 0.406: U4.8 19.98,50.19 18.98,49.19 17.98,49.19 Q2.3 17.93,49.24 C33.2
N$15
  Top 0.406: R15.1 88.78,30.14 D1.A
N$17
  Top 0.254: U$5.1 85.38,16.74 85.38,23.39 85.78,23.79 88.68,23.79 89.68,22.79 89.68,18.69 89.78,18.59 | R9.2 C9.1
  Top 0.305: R9.2 85.18,10.59 85.68,11.09 85.68,11.89 86.18,12.39 J7.11
  Top 0.406: J7.6 89.78,18.59 91.03,18.59 J7.7 J7.8 J7.9 J7.10 91.88,11.49 90.98,12.39 J7.11
N$19
  Top 0.254: R9.1 C9.2
N$20
  Top 0.406: C10.1 86.68,35.29 86.98,35.59 U1.2 87.18,40.09 87.18,43.49 83.28,43.49 82.98,43.49 76.78,43.49 75.24,41.95 J3.2
N$21
  Top 0.254: R17.2 37.06,42.47 D2.A
N$22
  Top 0.406: U$6.1 41.48,15.19 41.18,15.49 C19.2
N$23
  Top 0.254: U$6.2 43.73,13.04 43.18,12.49 C20.1
N$24
  Top 0.254: U$6.3 44.38,11.69 43.38,10.69 C20.2
N$25
  Top 0.254: L3.2 43.71,7.22 44.18,7.69 44.18,9.69 45.03,10.54 U$6.4
N$26
  Top 0.254: C21.2 45.78,2.89 | 45.78,2.89 42.01,2.89 L3.1 | U$6.6 46.33,14.14 45.68,13.49 45.68,9.09 45.88,8.89 45.88,2.99 45.78,2.89
N$27
  Top 0.254: U$6.7 C22.2
N$28
  Top 0.254: U$6.9 48.28,14.39 48.98,13.69 48.98,9.89 | C23.2 48.58,6.49 48.98,6.89 48.98,9.89 | 48.98,9.89 R10.1 50.28,8.59 51.08,7.79 R11.1
N$29
  Top 0.406: C25.2 20.48,15.49 20.98,14.99 U$7.1
N$30
  Top 0.254: U$7.2 23.03,13.34 22.68,12.99 C26.1
N$31
  Top 0.254: U$7.3 23.68,11.59 23.28,11.19 C26.2
N$32
  Top 0.254: U$7.4 24.33,10.74 23.48,9.89 23.48,8.19 22.81,7.52 L4.2
N$33
  Top 0.254: U$7.6 25.63,14.14 24.98,13.49 24.98,3.59 25.38,3.19 | 25.38,3.19 C27.2 | 25.38,3.19 21.11,3.19 L4.1
N$34
  Top 0.254: C28.2 26.28,12.59 U$7.7
N$35
  Top 0.254: U$7.9 27.58,14.19 28.28,13.49 28.28,9.79 | 28.28,9.79 28.28,7.19 27.98,6.89 C29.2 | 28.28,9.79 R12.1 29.58,8.59 30.48,7.69 R13.1
N$36
  Top 0.254: R18.1 37.76,10.54 D3.A
N$37
  Top 0.254: R19.2 40.03,29.12 D4.A
N$38
  Top 0.254: R19.1 42.63,31.69 U2.24
N$39
  Top 0.254: R20.2 16.23,42.52 D5.A
N$40
  Top 0.254: U4.9 20.29,48.7 19.58,47.99 19.58,45.19 18.98,44.59 R20.1
OUT1
  Top 0.406: U$1.18 67.58,20.76 U$1.17
  Top 0.61: 67.58,20.76 67.43,20.91 X1.1
OUT1_M2
  Top 0.305: U$6.18 47.18,20.69 U$6.17
  Top 0.61: 47.18,20.69 47.18,22.54 X3.1
OUT1_M3
  Top 0.305: U$7.18 26.58,20.49 U$7.17
  Top 0.61: 26.58,20.49 26.53,20.54 X4.1
OUT2
  Top 0.406: U$1.20 66.18,20.76 U$1.19
  Top 0.61: 66.18,20.76 X1.2
OUT2_M2
  Top 0.305: U$6.20 45.98,20.69 U$6.19
  Top 0.61: 45.98,20.69 X3.2
OUT2_M3
  Top 0.305: U$7.20 25.38,20.49 U$7.19
  Top 0.61: 25.38,20.49 25.28,20.59 X4.2
OUT3
  Top 0.305: 65.23,20.76 U$1.21
  Top 0.406: U$1.22 64.88,20.76 65.23,20.76
  Top 0.61: 64.88,20.76 64.88,22.74 X1.3
OUT3_M2
  Top 0.305: U$6.22 44.4,20.67 44.68,20.67 U$6.21
  Top 0.61: 44.68,20.67 44.68,22.54 X3.3
OUT3_M3
  Top 0.305: U$7.22 23.7,20.47 23.98,20.47 U$7.21
  Top 0.61: 23.98,20.47 23.98,23.04 X4.3
RESET  (via drill 0.6 pad 1.4)
  Top 0.254: U2.40 54.03,34.24 54.88,33.39 v54.88,32.39 | S3.1 S3.2 83.89,66 84.08,66.19 C14.1 85.63,66.14 R7.1 84.38,63.99 83.78,63.39 v83.78,60.09 | v59.18,42.19 59.18,44.79 X2.1 57.38,44.89 56.58,45.69 v56.58,51.79
  Bottom 0.254: v83.78,60.09 82.58,58.89 69.48,58.89 62.38,51.79 v56.58,51.79 | v54.88,32.39 54.88,35.59 56.48,37.19 56.48,39.49 v59.18,42.19
RTC_32KHZ  (via drill 0.35)
  Top 0.254: U4.1 20.38,55.79 20.18,55.99 v20.18,56.89 | v31.18,68.29 34.38,68.29 34.98,67.69 RTC1.1 33.78,65.1 33.46,65.41 R4.1
  Bottom 0.254: v31.18,68.29 24.38,68.29 20.18,64.09 v20.18,56.89
RTC_BAT  (via drill 0.6 pad 1.4)
  Top 0.254: RTC1.6 42.3,62.56 C36.1 43.01,63.14 C34.1
  Top 0.406: C34.1 44.88,62.94 U$4.+$2 44.88,56.59 v44.58,56.29 | v65.18,57.69 63.78,57.69 U$4.+$1
  Bottom 0.406: v44.58,56.29 45.98,57.69 v65.18,57.69
RTC_INT  (via drill 0.35)
  Top 0.254: U4.32 21.79,57.29 v21.58,57.49 | v21.48,63.29 21.48,65.49 22.38,66.39 27.48,66.39 28.46,65.41 R16.1 29.68,61.19 30.28,60.59 33.18,60.59 33.58,60.99 33.58,62.19 33.95,62.56 RTC1.3
  Bottom 0.254: v21.48,63.29 21.58,63.19 v21.58,57.49
RTC_RST  (via drill 0.35)
  Top 0.254: U4.19 33.48,51.79 34.38,52.69 34.38,54.49 35.38,55.49 v35.68,55.49 | RTC1.4 v34.98,60.09
  Bottom 0.254: v35.68,55.49 35.68,59.39 v34.98,60.09
RTC_SCL
  Top 0.254: R8.1 40.28,67.99 40.58,67.69 RTC1.8 39.39,65.1 38.08,63.79 38.08,59.99 37.38,59.29 26.38,59.29 25.98,58.89 U4.28
RTC_SDA
  Top 0.254: R14.1 39.58,69.59 41.68,67.49 41.68,63.99 41.52,63.83 RTC1.7 39.22,63.83 38.78,63.39 38.78,59.19 38.28,58.69 28.58,58.69 28.48,58.69 27.18,58.69 26.78,58.29 U4.27
RWS_DEN  (via drill 0.35)
  Top 0.254: U4.23 31.18,54.99 31.38,55.19 v31.38,57.09 | v34.38,71.19 34.72,71.53 U3.3
  Bottom 0.254: v34.38,71.19 33.08,69.89 33.08,67.09 30.58,64.59 30.58,57.89 v31.38,57.09
RWS_EN  (via drill 0.35)
  Top 0.254: U4.24 v29.88,57.09 | v32.38,71.19 33.45,72.26 U3.2
  Bottom 0.254: v29.88,57.09 29.88,64.79 32.38,67.29 v32.38,71.19
RWS_IS  (via drill 0.35)
  Top 0.254: U4.22 31.38,54.19 32.78,55.59 v32.78,57.09 | v36.18,71.19 35.99,71.39 U3.4
  Bottom 0.254: v36.18,71.19 33.78,68.79 33.78,66.89 31.28,64.39 31.28,58.59 v32.78,57.09
SPEED_CTL_M1
  Top 0.254: U$3.P$2 48.18,42.79 48.63,42.34 U2.3
SWCLK  (via drill 0.6 pad 1.4)
  Top 0.254: U2.45 57.33,36.74 v58.28,37.69 | v86.38,57.79 85.63,58.54 R6.1 | X2.4 62.23,48.64 v66.48,52.89
  Bottom 0.254: v86.38,57.79 85.78,57.19 70.78,57.19 v66.48,52.89 60.98,47.39 60.98,40.39 v58.28,37.69
SWDIO
  Top 0.254: U2.46 53.83,37.24 54.98,38.39 54.98,52.49 55.98,53.49 58.48,53.49 59.08,52.89 X2.5
T_USB_N
  Top 0.2: J7.2 89.23,14.87 87.43,14.87 87.28,15.02 84.16,15.02 U$5.3 77.03,14.09 73.81,17.32 73.81,27.42 71.53,29.69 48.28,29.69 48.13,29.84 U2.33
T_USB_P
  Top 0.2: J7.3 89.23,15.52 87.44,15.52 87.28,15.37 84.16,15.37 U$5.2 75.33,16.29 74.16,17.47 74.16,27.57 71.63,30.09 48.78,30.09 48.63,30.24 U2.34
USB_HOST_EN
  Top 0.254: U2.41 54.53,34.74 58.68,30.59 71.98,30.59 74.98,27.59 74.98,19.19 76.18,17.99 R3.2
V_BATT_STACK
  Top 0.406: J8.1 20.56,73.37 17.58,70.39 6.45,70.39 J1.101 3.08,71.18 3.08,72.29 3.68,72.89 14.28,72.89 15.38,71.79 15.86,71.79 J14.1 | J8.1 20.56,71.27 17.08,67.79 9.01,67.79 J1.75 6.38,67.78 6.38,65.79 6.88,65.29 15.98,65.29 21.48,70.79 21.48,72.77 J8.1
  Bottom 0.406: J14.1 17.76,70.47 15.08,67.79 9.01,67.79 J1.75 6.38,67.78 6.38,65.79 6.88,65.29 14.88,65.29 20.78,71.19 20.78,73.47 J8.1 | J14.1 14.46,70.39 6.45,70.39 J1.101 3.08,71.18 3.08,72.29 3.68,72.89 14.58,72.89 15.48,73.79 17.66,73.79 J14.1
  Bottom 1.27: J8.1 J14.1
V_USB  (via drill 0.6 pad 1.4)
  Top 0.406: J7.1 86.28,14.19 86.18,14.09 U$5.4 85.13,13.74 v84.08,12.69
  Bottom 0.406: v84.08,12.69 84.08,38.29 81.98,40.39 J3.1
VDDANA  (via drill 0.6 pad 1.4)
  Top 0.254: L2.2 85.41,30.89 C12.1 C16.1 78.58,29.79 74.58,29.79 v74.28,30.09 | U2.6 47.13,41.04 46.28,41.89 v44.18,41.89 | v56.58,42.19 59.58,39.19 62.08,39.19 66.68,43.79 v68.98,43.79
  Bottom 0.254: v68.98,43.79 68.98,38.79 74.28,33.49 v74.28,30.09 | v44.18,41.89 56.28,41.89 v56.58,42.19
VDDCORE
  Top 0.254: U2.43 55.13,35.74 59.18,31.69 74.88,31.69 75.68,30.89 C18.1

### Text on the board
tPlace: 12V | IN+ | 5V OUT6 | VBAT | GND | GND | 12VDRV | 5VuC | 5VO / STK | ON | OFF | ON | OFF | 5V / STK | GND | SDA | SCL
tNames: XL6009E1 / Step-Up / Converter | PWR Selector | RTC / BAT | SAMD21 / RESET | GND | +VBAT | +VBAT | ICSP | LED(D5) | SWD | USB / PWR | UART | STK / PWR | AT328 / PWR LED | LED(D5) | Motor3 | Motor1 | SAMD21 / PWR / LED | Motor2 | DRVs / PWR LED | H2 | H1 | SAMD21 / PROG | 2 | 1 | 2 | 1 | RWs-Firmware V1.5 / Gustavo Diaz Huenupan / gustavo.diaz@ing.uchile.cl / SPEL-UCHILE